# Altium project AL1000.PrjPcb
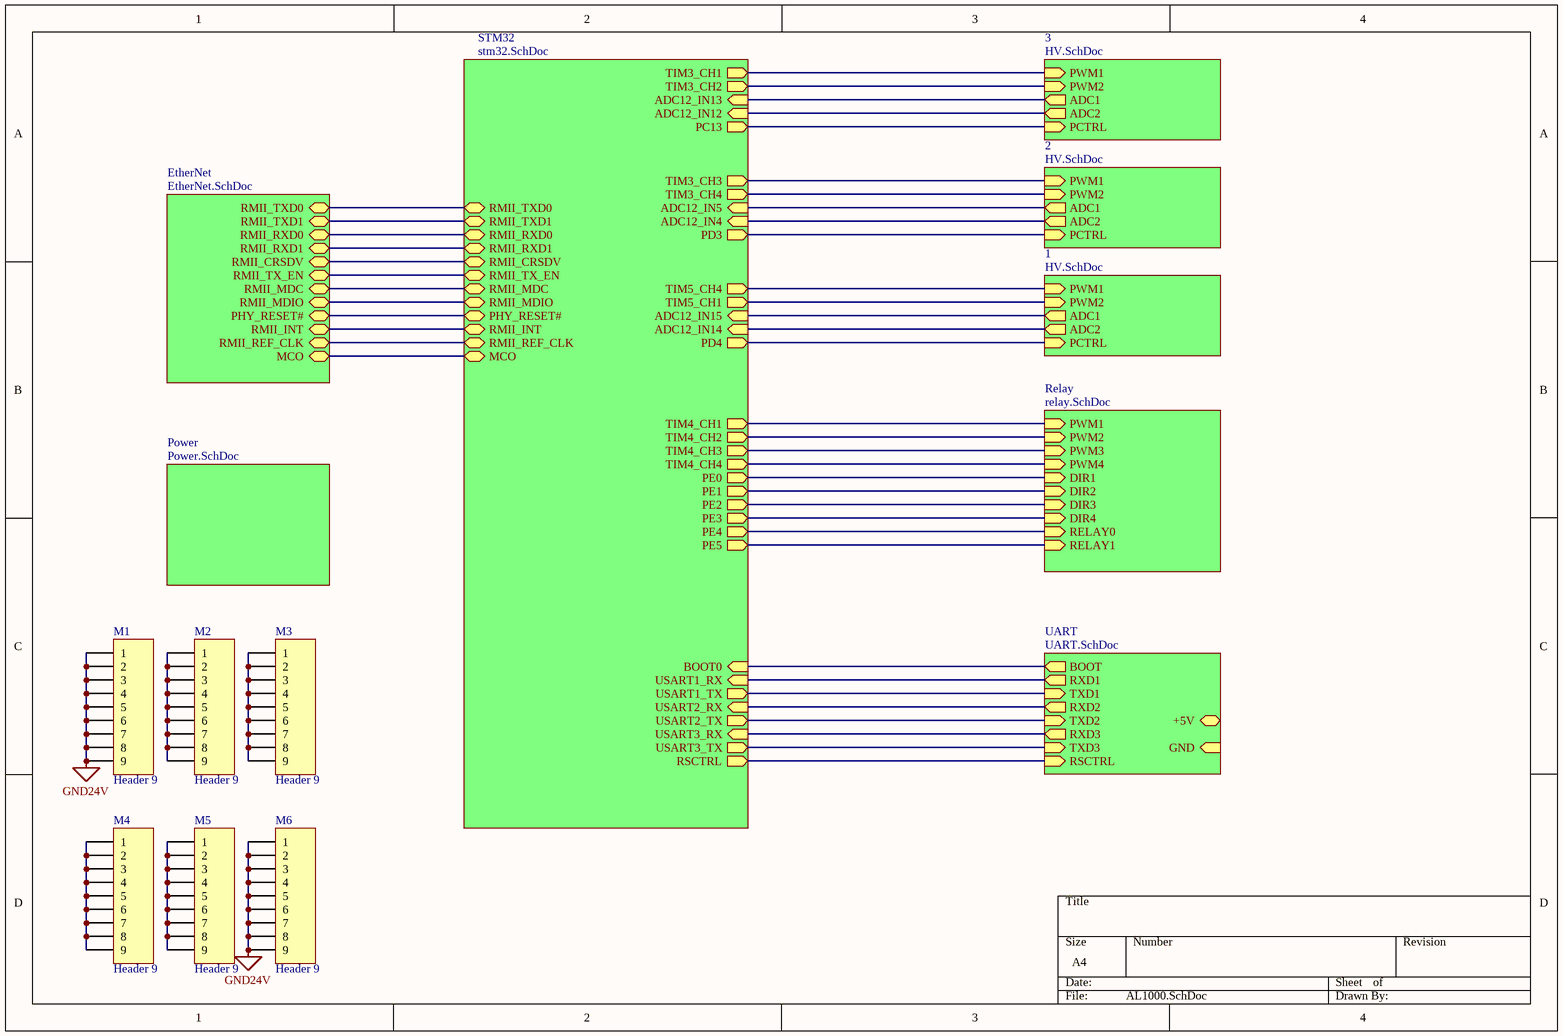
[diagram p0: AL1000.SchDoc]
7 sheets, 486 parts. Net scope: hierarchical (ports join the sheet entries above them; power ports are global).
Board file: AL1000.PcbDoc
Sheets:
  AL1000.SchDoc
    STM32 = stm32.SchDoc
    1 = HV.SchDoc
    Relay = relay.SchDoc
    UART = uart.SchDoc
    EtherNet = EtherNet.SchDoc
    Power = POWER.SchDoc
    3 = HV.SchDoc
    2 = HV.SchDoc

## Sheet AL1000.SchDoc
size A4; PageSetup: Record=PageOptions|CenterHorizontal=True|CenterVertical=True|PrintScale=1.00|XCorrection=1.00|YCorrection=1.00|PrintKind=1|BorderSize=5000000|LeftOffset=0|BottomOffset=0|Orientation=2|PaperLength=1000|PaperWidth=1000|Scale=100|PaperSource=7|PrintQuality=-3|MediaType=1|DitherType=10|PrintScaleMode=1|PaperKind=A1(594x841mm)|PaperIndex=135

### Parts
M1  Header 9  [LK]
M2  Header 9  [LK]
M3  Header 9  [LK]
M4  Header 9  [LK]
M5  Header 9  [LK]
M6  Header 9  [LK]

### Sub-sheets
1 = HV.SchDoc: ADC1 (out), ADC2 (out), PWM1 (in), PWM2 (in), PCTRL (in)
2 = HV.SchDoc: ADC1 (out), ADC2 (out), PWM1 (in), PWM2 (in), PCTRL (in)
3 = HV.SchDoc: ADC1 (out), ADC2 (out), PWM1 (in), PWM2 (in), PCTRL (in)
EtherNet = EtherNet.SchDoc: RMII_TXD0, RMII_TXD1, RMII_RXD0, RMII_RXD1, RMII_CRSDV, RMII_TX_EN, RMII_MDC, RMII_MDIO, PHY_RESET#, RMII_INT, RMII_REF_CLK, MCO
Power = Power.SchDoc: no entries
Relay = relay.SchDoc: DIR2 (in), DIR1 (in), PWM1 (in), PWM2 (in), PWM3 (in), PWM4 (in), DIR3 (in), DIR4 (in), RELAY0 (in), RELAY1 (in)
STM32 = stm32.SchDoc: TIM3_CH1 (out), TIM3_CH2 (out), TIM3_CH3 (out), TIM3_CH4 (out), ADC12_IN12 (in), ADC12_IN13 (in), ADC12_IN14 (in), ADC12_IN15 (in), PD3 (out), PD4 (out), RMII_TXD0, RMII_TXD1, RMII_RXD0, RMII_RXD1, RMII_CRSDV, RMII_TX_EN, RMII_MDC, RMII_MDIO, PHY_RESET#, RMII_INT, RMII_REF_CLK, MCO, USART1_TX (out), USART1_RX (in), USART2_TX (out), USART3_TX (out), USART2_RX (in), USART3_RX (in), RSCTRL (out), BOOT0 (in), TIM4_CH1 (out), TIM4_CH2 (out), TIM4_CH3 (out), TIM4_CH4 (out), PE0 (out), PE1 (out), PE2 (out), PE3 (out), TIM5_CH1 (out), TIM5_CH4 (out), ADC12_IN4 (in), ADC12_IN5 (in), PC13 (out), PE4 (out), PE5 (out)
UART = UART.SchDoc: BOOT (out), RXD1 (out), TXD1 (in), RXD2 (out), TXD2 (in), RXD3 (out), TXD3 (in), GND (in), +5V, RSCTRL (in)

### Nets
GND24V: M1.1 M1.2 M1.3 M1.4 M1.5 M1.6 M1.7 M1.8 M1.9 M6.1 M6.2 M6.3 M6.4 M6.5 M6.6 M6.7 M6.8 M6.9
PC1: sheet STM32/RMII_MDC, sheet EtherNet/RMII_MDC
PC2: sheet STM32/ADC12_IN12, sheet 3/ADC2
PC3: sheet STM32/ADC12_IN13, sheet 3/ADC1
PC4: sheet STM32/ADC12_IN14, sheet 1/ADC2
PC5: sheet STM32/ADC12_IN15, sheet 1/ADC1
PC6: sheet STM32/TIM3_CH1, sheet 3/PWM1
PC7: sheet STM32/TIM3_CH2, sheet 3/PWM2
PC8: sheet STM32/TIM3_CH3, sheet 2/PWM1
PC9: sheet STM32/TIM3_CH4, sheet 2/PWM2
PC10: sheet STM32/USART3_TX, sheet UART/TXD3
PC11: sheet STM32/USART3_RX, sheet UART/RXD3
PC13: sheet STM32/PC13, sheet 3/PCTRL
NetC42_2_2: sheet STM32/ADC12_IN5, sheet 2/ADC1
NetC46_2_2: sheet STM32/ADC12_IN4, sheet 2/ADC2
NetD4_1: sheet STM32/PE2, sheet Relay/DIR3
NetD4_2: sheet STM32/PE3, sheet Relay/DIR4
NetD4_3: sheet STM32/PE4, sheet Relay/RELAY0
NetD4_4: sheet STM32/PE5, sheet Relay/RELAY1
NetD4_23: sheet STM32/TIM5_CH1, sheet 1/PWM2
NetD4_24: sheet STM32/RMII_REF_CLK, sheet EtherNet/RMII_REF_CLK
NetD4_25: sheet STM32/RMII_MDIO, sheet EtherNet/RMII_MDIO
NetD4_26: sheet STM32/TIM5_CH4, sheet 1/PWM1
NetD4_48: sheet STM32/RMII_TX_EN, sheet EtherNet/RMII_TX_EN
NetD4_51: sheet STM32/RMII_TXD0, sheet EtherNet/RMII_TXD0
NetD4_52: sheet STM32/RMII_TXD1, sheet EtherNet/RMII_TXD1
NetD4_53: sheet STM32/RMII_INT, sheet EtherNet/RMII_INT
NetD4_55: sheet STM32/RMII_CRSDV, sheet EtherNet/RMII_CRSDV
NetD4_56: sheet STM32/RMII_RXD0, sheet EtherNet/RMII_RXD0
NetD4_57: sheet STM32/RMII_RXD1, sheet EtherNet/RMII_RXD1
NetD4_58: sheet STM32/PHY_RESET#, sheet EtherNet/PHY_RESET#
NetD4_59: sheet STM32/TIM4_CH1, sheet Relay/PWM1
NetD4_60: sheet STM32/TIM4_CH2, sheet Relay/PWM2
NetD4_61: sheet STM32/TIM4_CH3, sheet Relay/PWM3
NetD4_62: sheet STM32/TIM4_CH4, sheet Relay/PWM4
NetD4_67: sheet STM32/MCO, sheet EtherNet/MCO
NetD4_68: sheet STM32/USART1_TX, sheet UART/TXD1
NetD4_69: sheet STM32/USART1_RX, sheet UART/RXD1
NetD4_84: sheet STM32/PD3, sheet 2/PCTRL
NetD4_85: sheet STM32/PD4, sheet 1/PCTRL
NetD4_86: sheet STM32/USART2_TX, sheet UART/TXD2
NetD4_87: sheet STM32/USART2_RX, sheet UART/RXD2
NetD4_88: sheet STM32/RSCTRL, sheet UART/RSCTRL
NetD4_94: sheet STM32/BOOT0, sheet UART/BOOT
NetD4_97: sheet STM32/PE0, sheet Relay/DIR1
NetD4_98: sheet STM32/PE1, sheet Relay/DIR2
NetM2_1: M2.1 M2.2 M2.3 M2.4 M2.5 M2.6 M2.7 M2.8 M2.9
NetM3_1: M3.1 M3.2 M3.3 M3.4 M3.5 M3.6 M3.7 M3.8 M3.9
NetM4_1: M4.1 M4.2 M4.3 M4.4 M4.5 M4.6 M4.7 M4.8 M4.9
NetM5_1: M5.1 M5.2 M5.3 M5.4 M5.5 M5.6 M5.7 M5.8 M5.9

### Library data of the parts
M1-M6 = Header 9: Header, 9-Pin; LatestRevisionDate: 17-Jul-2002; LatestRevisionNote: Re-released for DXP Platform.; Publisher: Altium Limited

## Sheet stm32.SchDoc
size A3; PageSetup: Record=PageOptions|CenterHorizontal=True|CenterVertical=True|PrintScale=0.73|XCorrection=1.00|YCorrection=1.00|PrintKind=0|BorderSize=5000000|LeftOffset=0|BottomOffset=0|Orientation=2|PaperLength=1000|PaperWidth=1000|Scale=100|PaperSource=7|PrintQuality=600|MediaType=1|DitherType=10|PaperKind=A4|PrintScaleMode=1
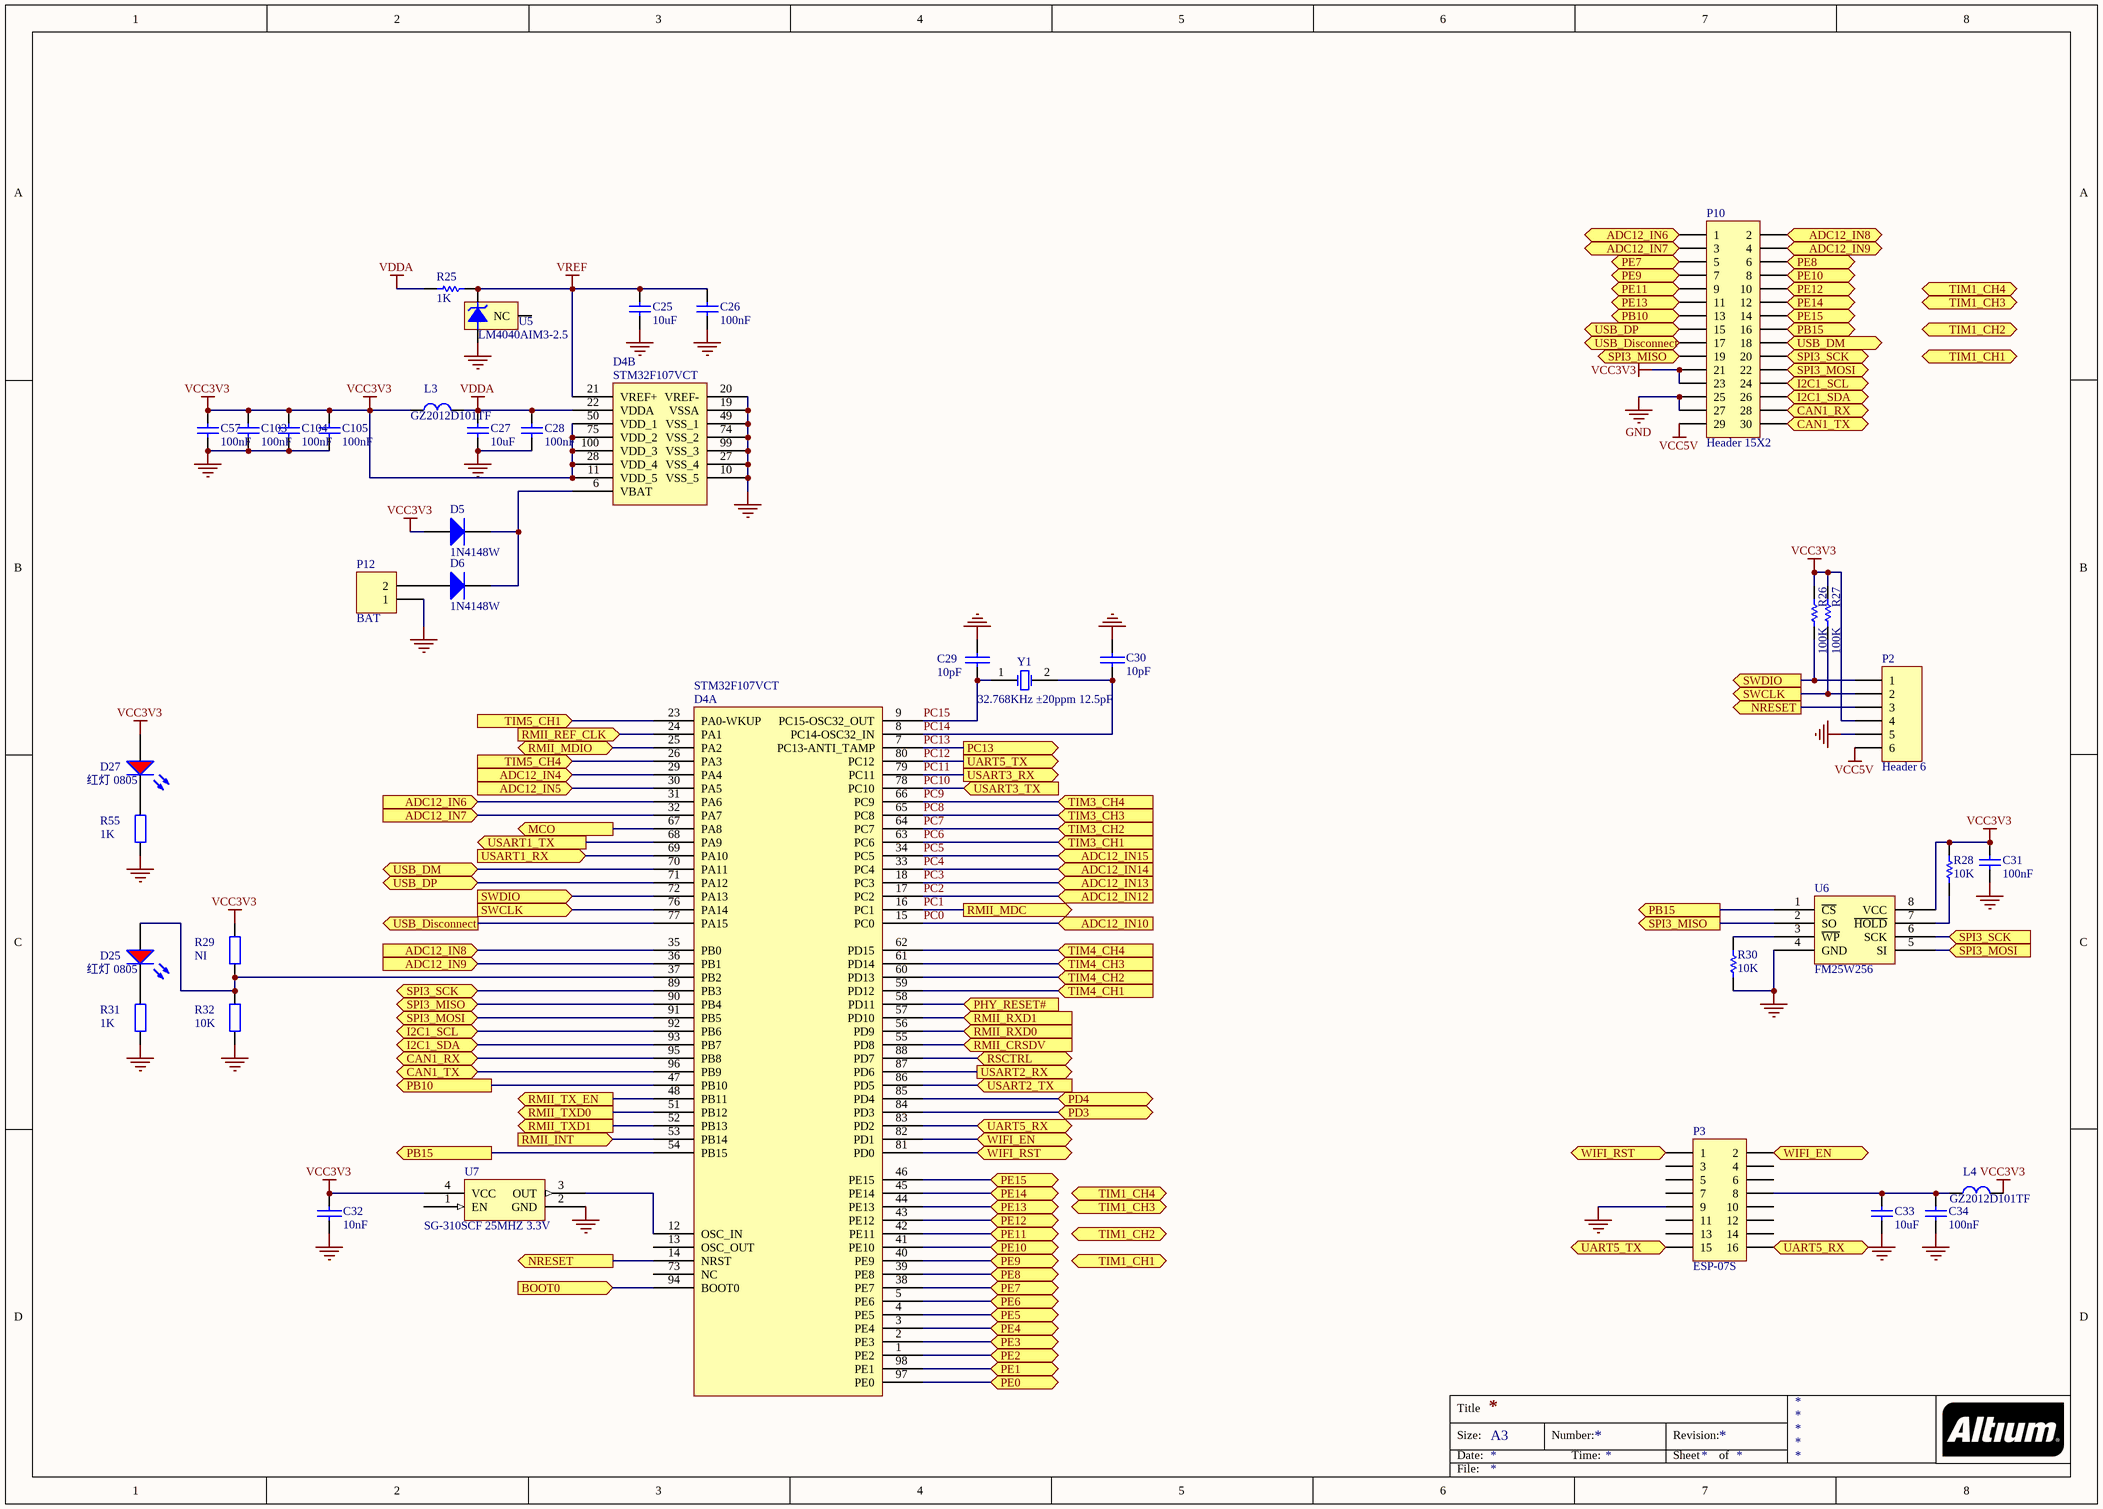
[diagram p1: stm32.SchDoc]

### Parts
C25  10uF  [0805_C]
C26  100nF  [0805_C]
C27  10uF  [0805_C]
C28  100nF  [0805_C]
C29  10pF  [0805_C]
C30  10pF  [0805_C]
C31  100nF  [0805_C]
C32  10nF  [0805_C]
C33  10uF  [0805_C]
C34  100nF  [0805_C]
C57  100nF  [0805_C]
C103  100nF  [0805_C]
C104  100nF  [0805_C]
C105  100nF  [0805_C]
D4  STM32F107VCT  [LQFP-100_14x14x05P]  (parts A,B of 2)
D5  1N4148W  [SOD-123]
D6  1N4148W  [SOD-123]
D25  红灯 0805  [0805_LED_S1]
D27  红灯 0805  [0805_LED_S1]
L3  GZ2012D101TF  [0805_L]
L4  GZ2012D101TF  [0805_L]
P2  Header 6  [TJC3-6A]
P3  ESP-07S  [ESP-07S]
P10  Header 15X2  [HDR2X15]
P12  BAT  [TJC3-2A]
R25  1K  [0805_R]
R26  100K  [0805_R]
R27  100K  [0805_R]
R28  10K  [0805_R]
R29  NI  [0805_R]
R30  10K  [0805_R]
R31  1K  [0805_R]
R32  10K  [0805_R]
R55  1K  [0805_R]
U5  LM4040AIM3-2.5  [MF03A_N]
U6  FM25W256  [SO8]
U7  SG-310SCF 25MHZ 3.3V  [SMD-3225_4P]
Y1  32.768KHz ±20ppm 12.5pF  [SMD-3215_2P FC - 135]

### Ports
ADC12_IN4 (in), ADC12_IN5 (in), ADC12_IN6 (in), ADC12_IN7 (in), ADC12_IN8 (in), ADC12_IN9 (in), ADC12_IN10 (in), ADC12_IN12 (in), ADC12_IN13 (in), ADC12_IN14 (in), ADC12_IN15 (in), BOOT0 (in), CAN1_RX, CAN1_TX, I2C1_SCL, I2C1_SDA, MCO (out), NRESET (out), PB10 (out), PB15 (out), PC13 (out), PD3, PD4, PE0, PE1, PE2, PE3, PE4, PE5, PE6, PE7, PE8, PE9, PE10, PE11, PE12, PE13, PE14, PE15, PHY_RESET# (in), RMII_CRSDV (in), RMII_INT (in), RMII_MDC (out), RMII_MDIO (bidir), RMII_REF_CLK (in), RMII_RXD0 (in), RMII_RXD1 (in), RMII_TX_EN (out), RMII_TXD0 (out), RMII_TXD1 (out), RSCTRL, SPI3_MISO, SPI3_MISO (out), SPI3_MOSI, SPI3_MOSI (in), SPI3_SCK, SPI3_SCK (in), SWCLK (in), SWCLK (out), SWDIO (in), SWDIO (out), TIM1_CH1 (in), TIM1_CH2 (in), TIM1_CH3 (in), TIM1_CH4 (in), TIM3_CH1 (in), TIM3_CH2 (in), TIM3_CH3 (in), TIM3_CH4 (in), TIM4_CH1 (in), TIM4_CH2 (in), TIM4_CH3 (in), TIM4_CH4 (in), TIM5_CH1 (in), TIM5_CH4 (in), UART5_RX, UART5_TX (out), USART1_RX (in), USART1_TX (out), USART2_RX (out), USART2_TX (in), USART3_RX (out), USART3_TX (in), USB_Disconnect (out), USB_DM (bidir), USB_DP (bidir), WIFI_EN, WIFI_RST

### Nets
GND: C25.1 C26.2 C27.1 C28.2 C29.1 C30.2 C31.1 C32.1 C33.1 C34.2 C57.2 C103.1 C104.1 C105.1 D4.10(VSS_5) D4.19(VSSA) D4.20(VREF-) D4.27(VSS_4) D4.49(VSS_1) D4.74(VSS_2) D4.99(VSS_3) P2.5 P3.9 P10.25 P10.27 P12.1 R30.2 R31.2 R32.2 R55.2 U5.2(-V) U6.4(GND) U7.2(GND)
VCC3V3: C31.2 C32.2 C57.1 C103.2 C104.2 C105.2 D4.11(VDD_5) D4.28(VDD_4) D4.50(VDD_1) D4.75(VDD_2) D4.100(VDD_3) D5.1(A) D27.A L3.1 L4.2 P2.4 P10.21 P10.23 R26.2 R27.2 R28.2 R29.1 U6.8(VCC) U7.4(VCC)
VCC5V: P2.6 P10.29
VDDA: C27.2 C28.1 D4.22(VDDA) L3.2 R25.1
VREF: C25.2 C26.1 D4.21(VREF+) R25.2 U5.1(+V)
PC0: D4.15(PC0) ; port ADC12_IN10
PC1: D4.16(PC1) ; port RMII_MDC
PC2: D4.17(PC2) ; port ADC12_IN12
PC3: D4.18(PC3) ; port ADC12_IN13
PC4: D4.33(PC4) ; port ADC12_IN14
PC5: D4.34(PC5) ; port ADC12_IN15
PC6: D4.63(PC6) ; port TIM3_CH1
PC7: D4.64(PC7) ; port TIM3_CH2
PC8: D4.65(PC8) ; port TIM3_CH3
PC9: D4.66(PC9) ; port TIM3_CH4
PC10: D4.78(PC10) ; port USART3_TX
PC11: D4.79(PC11) ; port USART3_RX
PC12: D4.80(PC12) P3.15 ; port UART5_TX
PC13: D4.7(PC13-ANTI_TAMP) ; port PC13
PC14: C30.1 D4.8(PC14-OSC32_IN) Y1.2(OSC2)
PC15: C29.2 D4.9(PC15-OSC32_OUT) Y1.1(OSC1)
NetC33_2: C33.2 C34.1 L4.1 P3.8
NetC42_2_2: D4.30(PA5) ; port ADC12_IN5
NetC46_2_2: D4.29(PA4) ; port ADC12_IN4
NetD4_1: D4.1(PE2) ; port PE2
NetD4_2: D4.2(PE3) ; port PE3
NetD4_3: D4.3(PE4) ; port PE4
NetD4_4: D4.4(PE5) ; port PE5
NetD4_5: D4.5(PE6) ; port PE6
NetD4_6: D4.6(VBAT) D5.2(K) D6.2(K)
NetD4_12: D4.12(OSC_IN) U7.3(OUT)
NetD4_14: D4.14(NRST) P2.3 ; port NRESET
NetD4_23: D4.23(PA0-WKUP) ; port TIM5_CH1
NetD4_24: D4.24(PA1) ; port RMII_REF_CLK
NetD4_25: D4.25(PA2) ; port RMII_MDIO
NetD4_26: D4.26(PA3) ; port TIM5_CH4
NetD4_31: D4.31(PA6) P10.1 ; port ADC12_IN6
NetD4_32: D4.32(PA7) P10.3 ; port ADC12_IN7
NetD4_35: D4.35(PB0) P10.2 ; port ADC12_IN8
NetD4_36: D4.36(PB1) P10.4 ; port ADC12_IN9
NetD4_37: D4.37(PB2) D25.A R29.2 R32.1
NetD4_38: D4.38(PE7) P10.5 ; port PE7
NetD4_39: D4.39(PE8) P10.6 ; port PE8
NetD4_40: D4.40(PE9) P10.7 ; port PE9
NetD4_41: D4.41(PE10) P10.8 ; port PE10
NetD4_42: D4.42(PE11) P10.9 ; port PE11
NetD4_43: D4.43(PE12) P10.10 ; port PE12
NetD4_44: D4.44(PE13) P10.11 ; port PE13
NetD4_45: D4.45(PE14) P10.12 ; port PE14
NetD4_46: D4.46(PE15) P10.14 ; port PE15
NetD4_47: D4.47(PB10) P10.13 ; port PB10
NetD4_48: D4.48(PB11) ; port RMII_TX_EN
NetD4_51: D4.51(PB12) ; port RMII_TXD0
NetD4_52: D4.52(PB13) ; port RMII_TXD1
NetD4_53: D4.53(PB14) ; port RMII_INT
NetD4_54: D4.54(PB15) P10.16 U6.1(~{CS}) ; port PB15
NetD4_55: D4.55(PD8) ; port RMII_CRSDV
NetD4_56: D4.56(PD9) ; port RMII_RXD0
NetD4_57: D4.57(PD10) ; port RMII_RXD1
NetD4_58: D4.58(PD11) ; port PHY_RESET#
NetD4_59: D4.59(PD12) ; port TIM4_CH1
NetD4_60: D4.60(PD13) ; port TIM4_CH2
NetD4_61: D4.61(PD14) ; port TIM4_CH3
NetD4_62: D4.62(PD15) ; port TIM4_CH4
NetD4_67: D4.67(PA8) ; port MCO
NetD4_68: D4.68(PA9) ; port USART1_TX
NetD4_69: D4.69(PA10) ; port USART1_RX
NetD4_70: D4.70(PA11) P10.18 ; port USB_DM
NetD4_71: D4.71(PA12) P10.15 ; port USB_DP
NetD4_72: D4.72(PA13) P2.1 R26.1 ; port SWDIO
NetD4_76: D4.76(PA14) P2.2 R27.1 ; port SWCLK
NetD4_77: D4.77(PA15) P10.17 ; port USB_Disconnect
NetD4_81: D4.81(PD0) P3.1 ; port WIFI_RST
NetD4_82: D4.82(PD1) P3.2 ; port WIFI_EN
NetD4_83: D4.83(PD2) P3.16 ; port UART5_RX
NetD4_84: D4.84(PD3) ; port PD3
NetD4_85: D4.85(PD4) ; port PD4
NetD4_86: D4.86(PD5) ; port USART2_TX
NetD4_87: D4.87(PD6) ; port USART2_RX
NetD4_88: D4.88(PD7) ; port RSCTRL
NetD4_89: D4.89(PB3) P10.20 U6.6(SCK) ; port SPI3_SCK
NetD4_90: D4.90(PB4) P10.19 U6.2(SO) ; port SPI3_MISO
NetD4_91: D4.91(PB5) P10.22 U6.5(SI) ; port SPI3_MOSI
NetD4_92: D4.92(PB6) P10.24 ; port I2C1_SCL
NetD4_93: D4.93(PB7) P10.26 ; port I2C1_SDA
NetD4_94: D4.94(BOOT0) ; port BOOT0
NetD4_95: D4.95(PB8) P10.28 ; port CAN1_RX
NetD4_96: D4.96(PB9) P10.30 ; port CAN1_TX
NetD4_97: D4.97(PE0) ; port PE0
NetD4_98: D4.98(PE1) ; port PE1
NetD6_1: D6.1(A) P12.2
NetD25_K: D25.K R31.1
NetD27_K: D27.K R55.1
NetR28_1: R28.1 U6.7(~{HOLD})
NetR30_1: R30.1 U6.3(~{WP})

Not connected (* = marked no-connect by the designer): D4 13(OSC_OUT) 73(NC); P3 3 4 5 6 7 10 11 12 13 14; U5 3(NC); U7 1(EN)

### Notes on the sheet
- Title
- Size:
- Date:
- A3
- Number:
- Time:
- Revision:
- Sheet
- of
- File:

### Library data of the parts
C25 C27 C33 = 0805 10uF (106) 10% 25V: 贴片电容; ComponentLink1Description: 供应商链接; ComponentLink1URL: http://www.szlcsc.com/product/details_16532.html; Package: 0805; Supplier: LC; SuppliersPartNumber: C15850
C26 C28 C31 C34 C57 C103-C105 = 0805 100nF(104) 10% 50V: 贴片电容; ComponentLink1Description: 供应商链接; ComponentLink1URL: http://www.szlcsc.com/product/details_50686.html; Package: 0805; Supplier: LC; SuppliersPartNumber: C49678
C29 C30 = CAP: Capacitor
C32 = G-CC41-0805-CG-50V-300J: 多层瓷介电容; 厂家: 元六; 质量保证等级: G; 质量等级: A2; 技术规范: Q/QYL20024-; 是否在目录内: 1N 2Y; 供货周期: 28; VALUE: G-CC41-0805-CG-50V-300J
D4 = BARRACUDA_256K: VALUE: MCU电路STM32F107VCT6; 厂家: ST
D5 D6 = Diode: Default Diode; Published: 8-Jun-2000; LatestRevisionDate: 17-Jul-2002; LatestRevisionNote: Re-released for DXP Platform.; PackageVersion: Sep-1996; PackageReference: SMC; Publisher: Altium Limited; Code_JEDEC: DO-214-AB
D25 D27 = 0805 红灯: 发光二极管; ComponentLink1Description: 供应商链接; ComponentLink1URL: http://www.szlcsc.com/product/details_2668.html; Package: 0805; Supplier: LC; SuppliersPartNumber: C2295
L3 L4 = L1: VALUE: 磁珠742792031; 厂家: 伍尔特
P2 = Header 6: Header, 6-Pin; LatestRevisionDate: 17-Jul-2002; LatestRevisionNote: Re-released for DXP Platform.; Publisher: Altium Limited
P3 = Header 8X2: Header, 8-Pin, Dual row; LatestRevisionDate: 17-Jul-2002; LatestRevisionNote: Re-released for DXP Platform.; Publisher: Altium Limited
P10 = Header 15X2: Header, 15-Pin, Dual row; LatestRevisionDate: 17-Jul-2002; LatestRevisionNote: Re-released for DXP Platform.; Publisher: Altium Limited
P12 = Header 2: Header, 2-Pin; LatestRevisionDate: 17-Jul-2002; LatestRevisionNote: Re-released for DXP Platform.; Publisher: Altium Limited
R25 = res1: Resistor; Published: 8-Jun-2000; Revision: July-2002: Re-released for DXP Platform.; Publisher: Altium Limited; Value: 1K
R26-R28 = Res1: Resistor; Value: 1K; Published: 8-Jun-2000; LatestRevisionDate: 17-Jul-2002; LatestRevisionNote: Re-released for DXP Platform.; PackageReference: AXIAL-0.3; Publisher: Altium Limited
R29 = RMK2012KBxxx（10～1M）F: 贴片电阻; 质量保证等级: GJB; 技术规范: GJB1432A-99; 厂家: 718厂; VALUE: RMK2012KBxxxF
R30 = res1: Resistor; Value: 1K; Published: 8-Jun-2000; Revision: July-2002: Re-released for DXP Platform.; Publisher: Altium Limited
R31 R55 = RMK2012KBxxx（10～1M）F: 贴片电阻; 质量保证等级: GJB; 技术规范: GJB1432A-99; 厂家: 718厂; VALUE: RMK2012KB102F
R32 = RMK2012KBxxx（10～1M）F: 贴片电阻; 质量保证等级: GJB; 技术规范: GJB1432A-99; 厂家: 718厂; VALUE: RMK2012KB103F
U5 = LM4040AIM3-2.5: Precision Micropower Shunt Voltage Reference, 3-pin SOT-23; Manufacturer: National Semiconductor; PackageTopMarking: R2A*XTT; PowerWise: N; CompType: Voltage Reference IC; High-Reliability: Y; DatasheetVersion: Apr-2005; PackageVersion: revB, Mar-2003; PackageReference: MF03A; PackageDescription: Molded SOT-23, .115 x .051 x .037in Body, 3 Lead, .075 in Pitch; PartNumber: LM4040AIM3-2.5; RoHS: N; PinCount: 3; ComponentLink1Description: Manufacturer URL; ComponentLink1URL: http://www.national.com/; ComponentLink2Description: LM4040 Datasheet; ComponentLink2URL: http://www.national.com/ds/LM/LM4040.pdf; ComponentLink3Description: LM4040 Web Page; ComponentLink3URL: http://www.national.com/pf/LM/LM4040.html; ComponentLink4Description: MF03A Package Page; ComponentLink4URL: http://www.national.com/packaging/folders/mf03a.html
U6 = SPI_FLASH
U7 = SM7745HEV-50.0M
Y1 = SMD-3215_2P 32.768KHz 20ppm 12.5pF: 贴片晶振; ComponentLink1Description: 供应商链接; ComponentLink1URL: http://www.szlcsc.com/product/details_33310.html; Package: SMD-3215_2P; Supplier: LC; SuppliersPartNumber: C32346

## Sheet HV.SchDoc
size A3
Used 3 times, as channels 1, 3, 2. Parts and nets are listed once, with the designators drawn on the sheet.
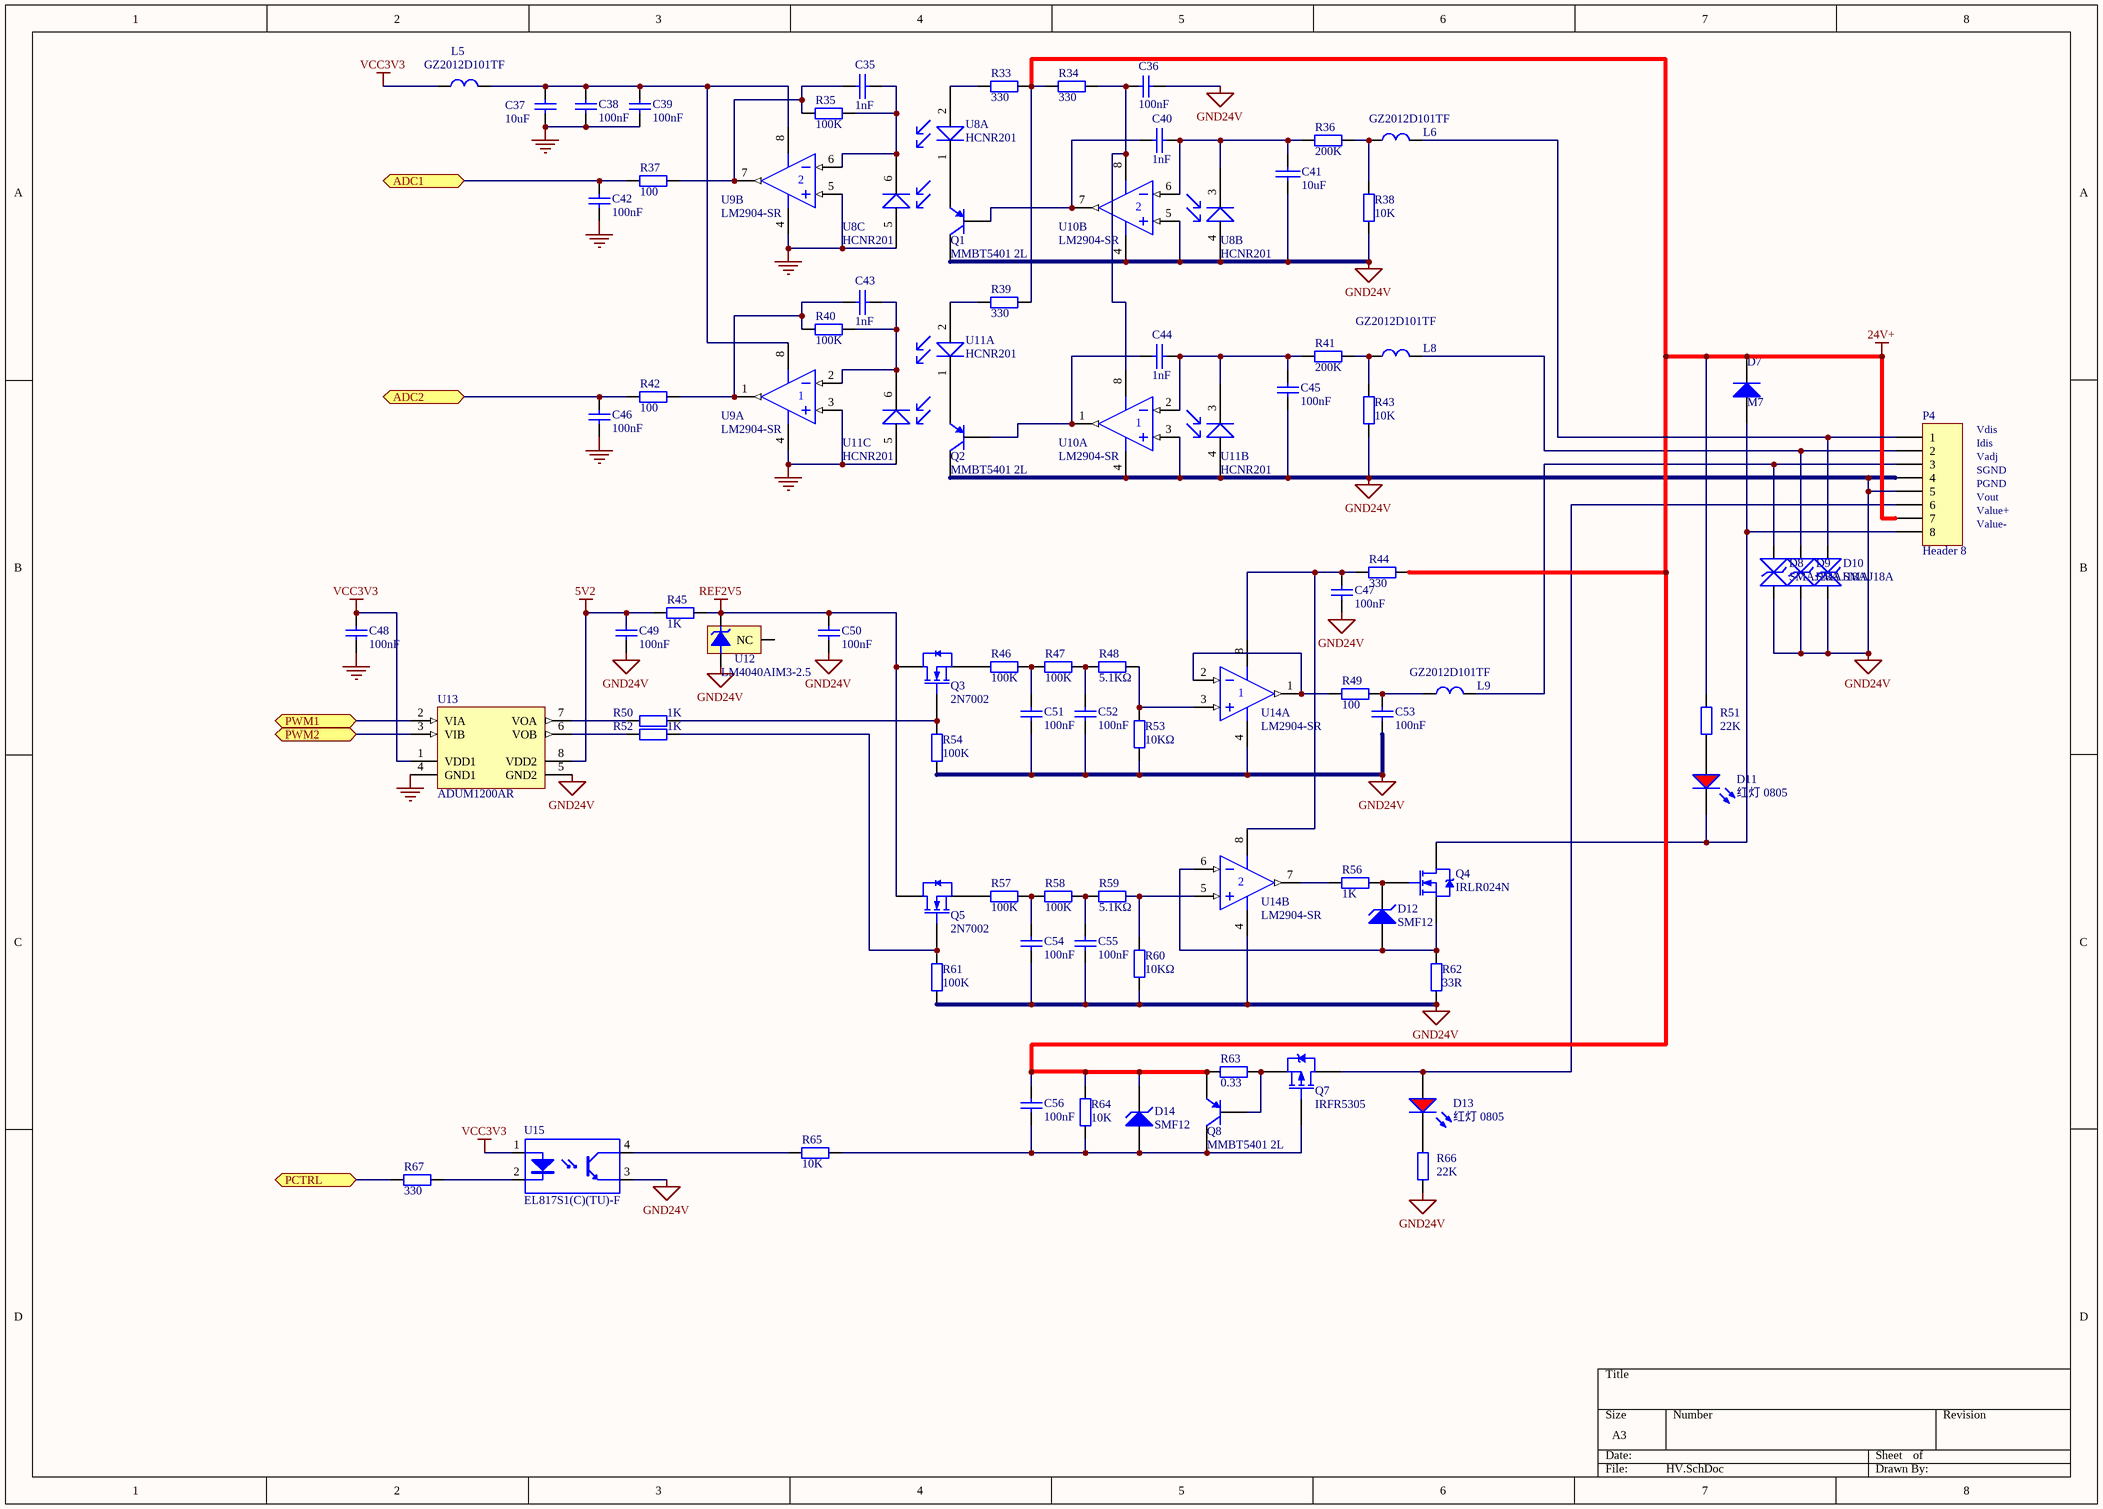
[diagram p2: HV.SchDoc]

### Parts
C35  1nF  [0805_C]
C36  100nF  [0805_C]
C37  10uF  [0805_C]
C38  100nF  [0805_C]
C39  100nF  [0805_C]
C40  1nF  [0805_C]
C41  10uF  [0805_C]
C42  100nF  [0805_C]
C43  1nF  [0805_C]
C44  1nF  [0805_C]
C45  100nF  [0805_C]
C46  100nF  [0805_C]
C47  100nF  [0805_C]
C48  100nF  [0805_C]
C49  100nF  [0805_C]
C50  100nF  [0805_C]
C51  100nF  [0805_C]
C52  100nF  [0805_C]
C53  100nF  [0805_C]
C54  100nF  [0805_C]
C55  100nF  [0805_C]
C56  100nF  [0805_C]
D7  M7  [SMA(DO-214AC)_S1]
D8  SMAJ18A  [SMA]
D9  SMAJ18A  [SMA]
D10  SMAJ18A  [SMA]
D11  红灯 0805  [0805_LED_S1]
D12  SMF12  [SOD-123]
D13  红灯 0805  [0805_LED_S1]
D14  SMF12  [SOD-123]
L5  GZ2012D101TF  [0805_L]
L6  GZ2012D101TF  [0805_L]
L8  GZ2012D101TF  [0805_L]
L9  GZ2012D101TF  [0805_L]
P4  Header 8  [MC1.5/8-ST-3.81]
Q1  MMBT5401 2L  [SOT-23(SOT-23-3)]
Q2  MMBT5401 2L  [SOT-23(SOT-23-3)]
Q3  2N7002  [SOT-23(SOT-23-3)]
Q4  IRLR024N  [TO-252AA_N]
Q5  2N7002  [SOT-23(SOT-23-3)]
Q7  IRFR5305  [TO-252AA_N]
Q8  MMBT5401 2L  [SOT-23(SOT-23-3)]
R33  330  [0805_R]
R34  330  [0805_R]
R35  100K  [0805_R]
R36  200K  [0805_R]
R37  100  [0805_R]
R38  10K  [0805_R]
R39  330  [0805_R]
R40  100K  [0805_R]
R41  200K  [0805_R]
R42  100  [0805_R]
R43  10K  [0805_R]
R44  330  [0805_R]
R45  1K  [0805_R]
R46  100K  [0805_R]
R47  100K  [0805_R]
R48  5.1KΩ  [0805_R]
R49  100  [0805_R]
R50  1K  [0805_R]
R51  22K  [R0805]
R52  1K  [0805_R]
R53  10KΩ  [0805_R]
R54  100K  [0805_R]
R56  1K  [0805_R]
R57  100K  [0805_R]
R58  100K  [0805_R]
R59  5.1KΩ  [0805_R]
R60  10KΩ  [0805_R]
R61  100K  [0805_R]
R62  33R  [R2512]
R63  0.33  [R2512]
R64  10K  [0805_R]
R65  10K  [0805_R]
R66  22K  [0805_R]
R67  330  [0805_R]
U8  HCNR201  [SMD-8_9.0mm]  (parts A,B,C of 3)
U9  LM2904-SR  [SOIC-8_150mil]  (parts A,B of 2)
U10  LM2904-SR  [SOIC-8_150mil]  (parts A,B of 2)
U11  HCNR201  [SMD-8_9.0mm]  (parts A,B,C of 3)
U12  LM4040AIM3-2.5  [MF03A_N]
U13  ADUM1200AR  [ADI-R-8_N]
U14  LM2904-SR  [SOIC-8_150mil]  (parts A,B of 2)
U15  EL817S1(C)(TU)-F  [LC-SMD-4]

### Ports
ADC1, ADC2, PCTRL, PWM1, PWM2

### Nets
5V2: C49.2 R45.2 U13.8(VDD2)
24V+: C56.2 D7.2(K) D14.2(K) P4.7 Q8.2(E) R33.1 R34.2 R39.1 R44.1 R51.1 R63.2 R64.2
GND: C37.1 C38.1 C39.1 C42.1 C46.1 C48.1 U8.5(+) U9.3(IN+) U9.4(V-) U9.5(IN+) U11.5(+) U13.4(GND1)
GND24V: C36.1 C41.1 C45.1 C47.1 C49.1 C50.1 C51.1 C52.1 C53.1 C54.1 C55.1 D8.1 D9.1 D10.1 P4.4 P4.5 Q1.3(C) Q2.3(C) R38.1 R43.1 R53.2 R54.2 R60.2 R61.2 R62.1 R66.2 U8.4(+) U10.3(IN+) U10.4(V-) U10.5(IN+) U11.4(+) U12.2(-V) U13.5(GND2) U14.4(V-) U15.3(E)
REF2V5: C50.2 Q3.3(D) Q5.3(D) R45.1 U12.1(+V)
VCC3V3: C48.2 L5.1 U13.1(VDD1) U15.1(A)
ADC1: C42.2 R37.2 ; port ADC1
ADC2: C46.2 R42.2 ; port ADC2
PCTRL: R67.1 ; port PCTRL
PWM1: U13.2(VIA) ; port PWM1
PWM2: U13.3(VIB) ; port PWM2
NetC35_1: C35.1 R35.2 U8.6(-) U9.6(IN-)
NetC35_2: C35.2 R35.1 R37.1 U9.7(OUT)
NetC36_2: C36.2 R34.1 U10.8(V+)
NetC37_2: C37.2 C38.2 C39.2 L5.2 U9.8(V+)
NetC40_1: C40.1 C41.2 R36.1 U8.3(-) U10.6(IN-)
NetC40_2: C40.2 Q1.1(B) U10.7(OUT)
NetC43_1: C43.1 R40.2 U9.2(IN-) U11.6(-)
NetC43_2: C43.2 R40.1 R42.1 U9.1(OUT)
NetC44_1: C44.1 C45.2 R41.1 U10.2(IN-) U11.3(-)
NetC44_2: C44.2 Q2.1(B) U10.1(OUT)
NetC47_2: C47.2 R44.2 U14.8(V+)
NetC51_2: C51.2 R46.1 R47.2
NetC52_2: C52.2 R47.1 R48.2
NetC53_2: C53.2 L9.2 R49.1
NetC54_2: C54.2 R57.1 R58.2
NetC55_2: C55.2 R58.1 R59.2
NetC56_1: C56.1 D14.1(A) Q7.1(G) Q8.3(C) R64.1 R65.1
NetD7_1: D7.1(A) D11.K P4.8 Q4.4(D)
NetD8_2: D8.2 L9.1 P4.3
NetD9_2: D9.2 L8.2 P4.2
NetD10_2: D10.2 L6.2 P4.1
NetD11_A: D11.A R51.2
NetD12_1: D12.1(A) Q4.3(S) R62.2 U14.6(IN-)
NetD12_2: D12.2(K) Q4.1(G) R56.1
NetD13_A: D13.A P4.6 Q7.4(D)
NetD13_K: D13.K R66.1
NetL6_1: L6.1 R36.2 R38.2
NetL8_1: L8.1 R41.2 R43.2
NetQ1_2: Q1.2(E) U8.1(-)
NetQ2_2: Q2.2(E) U11.1(-)
NetQ3_1: Q3.1(G) R50.2 R54.1
NetQ3_2: Q3.2(S) R46.2
NetQ5_1: Q5.1(G) R52.2 R61.1
NetQ5_2: Q5.2(S) R57.2
NetQ7_3: Q7.3(S) Q8.1(B) R63.1
NetR33_2: R33.2 U8.2(+)
NetR39_2: R39.2 U11.2(+)
NetR48_1: R48.1 R53.1 U14.3(IN+)
NetR49_2: R49.2 U14.1(OUT) U14.2(IN-)
NetR50_1: R50.1 U13.7(VOA)
NetR52_1: R52.1 U13.6(VOB)
NetR56_2: R56.2 U14.7(OUT)
NetR59_1: R59.1 R60.1 U14.5(IN+)
NetR65_2: R65.2 U15.4(C)
NetR67_2: R67.2 U15.2(K)

Not connected (* = marked no-connect by the designer): U12 3(NC)

### Channels
1: designators end in _1; ports ADC1=PC5 ADC2=PC4 PCTRL=NetD4_85 PWM1=NetD4_26 PWM2=NetD4_23
3: designators end in _3; ports ADC1=PC3 ADC2=PC2 PCTRL=PC13 PWM1=PC6 PWM2=PC7
2: designators end in _2; ports ADC1=NetC42_2_2 ADC2=NetC46_2_2 PCTRL=NetD4_84 PWM1=PC8 PWM2=PC9

### Notes on the sheet
- Vdis
- Idis
- Vadj
- SGND
- PGND
- Vout
- Value+
- Value-

### Library data of the parts
C35 C40 C43 C44 = CAP: Capacitor
C36 C38 C39 C42 C45-C56 = 0805 100nF(104) 10% 50V: 贴片电容; ComponentLink1Description: 供应商链接; ComponentLink1URL: http://www.szlcsc.com/product/details_50686.html; Package: 0805; Supplier: LC; SuppliersPartNumber: C49678
C37 = 1206 10uF (106) 10% 50V: 贴片电容; ComponentLink1Description: 供应商链接; ComponentLink1URL: http://www.szlcsc.com/product/details_14236.html; Package: 1206; Supplier: LC; SuppliersPartNumber: C13585
C41 = CC: Capacitor
D7 = SMA(DO-214AC) M7: 二极管; 备注: 1N4007 4007 编号C2464 已经停售, 使用新物料编号C95872; ComponentLink1Description: 供应商链接; ComponentLink1URL: http://www.szlcsc.com/product/details_2841.html; Package: SMA(DO-214AC); Supplier: LC; SuppliersPartNumber: C95872
D8-D10 = TVS
D11 D13 = 0805 红灯: 发光二极管; ComponentLink1Description: 供应商链接; ComponentLink1URL: http://www.szlcsc.com/product/details_2668.html; Package: 0805; Supplier: LC; SuppliersPartNumber: C2295
D12 D14 = D Zener: Zener Diode; Published: 8-Jun-2000; LatestRevisionDate: 17-Jul-2002; LatestRevisionNote: Re-released for DXP Platform.; PackageReference: DIODE-0.7; Publisher: Altium Limited; PackageDescription: Diode, Thru-Hole; 2 Leads; 0.7 in Pin Spacing
L5 L6 L8 L9 = L1
P4 = Header 8: Header, 8-Pin; LatestRevisionDate: 17-Jul-2002; LatestRevisionNote: Re-released for DXP Platform.; Publisher: Altium Limited
Q1 Q2 Q8 = SOT-23 MMBT5401 2L: 三极管; ComponentLink1Description: 供应商链接; ComponentLink1URL: http://www.szlcsc.com/product/details_8818.html; Package: SOT-23; Supplier: LC; SuppliersPartNumber: C8326
Q3 Q5 = 2N7002 7002: MOS(场效应管); ComponentLink1Description: 供应商链接; ComponentLink1URL: http://www.szlcsc.com/product/details_9040.html; Package: SOT-23(SOT-23-3); Supplier: LC; SuppliersPartNumber: C8545
Q4 = IRLR024N: HEXFET Power MOSFET; Note: Pin 2 is trimmed and is electrically connected to Drain.; Published: 8-Jun-2000; LatestRevisionDate: 20-Nov-2009; LatestRevisionNote: IPC-7351 Footprint Added.; PackageVersion: Feb-2003; PackageReference: TO-252AA; Publisher: Altium Limited; PackageDescription: 3-Pin HEXFET Package 2.28 mm Pitch, 9.9 mm Lead Span; Code_JEDEC: TO-252-AA; ComponentLink1Description: Manufacturer Link; ComponentLink1URL: http://www.irf.com/; ComponentLink2Description: Datasheet; ComponentLink2URL: http://www.irf.com/product-info/datasheets/data/irlr024n.pdf
Q7 = IRFR5305: HEXFET Power MOSFET; Note: Pin 2 is trimmed and is electrically connected to Drain.; Published: 8-Jun-2000; LatestRevisionDate: 20-Nov-2009; LatestRevisionNote: IPC-7351 Footprint Added.; DatasheetVersion: PD-9.1402; PackageReference: TO-252AA; Publisher: Altium Limited; PackageDescription: 3-Pin HEXFET Package 2.28 mm Pitch, 9.9 mm Lead Span; ComponentLink1Description: Manufacturer Link; ComponentLink1URL: http://www.irf.com/; ComponentLink2Description: Datasheet; ComponentLink2URL: http://www.irf.com/product-info/datasheets/data/irfr5305.pdf; PackageVersion: Feb-2003; Code_JEDEC: TO-252-AA
R33-R43 R62-R65 R67 = Res2: Resistor; Value: 1K; Published: 8-Jun-2000; LatestRevisionDate: 17-Jul-2002; LatestRevisionNote: Re-released for DXP Platform.; PackageReference: AXIAL-0.4; Publisher: Altium Limited
R44 = 0805 100Ω (1000) 1%: 贴片电阻; ComponentLink1Description: 供应商链接; ComponentLink1URL: http://www.szlcsc.com/product/details_18096.html; Package: 0805; Supplier: LC; SuppliersPartNumber: C17408
R45-R47 R49 R50 R52 R54 R56-R58 R61 = 0805 100KΩ (1003) 1%: 贴片电阻; ComponentLink1Description: 供应商链接; ComponentLink1URL: http://www.szlcsc.com/product/details_18095.html; Package: 0805; Supplier: LC; SuppliersPartNumber: C17407
R48 R59 = 0805 5.1KΩ (5101) 1%: 贴片电阻; ComponentLink1Description: 供应商链接; ComponentLink1URL: http://www.szlcsc.com/product/details_28584.html; Package: 0805; Supplier: LC; SuppliersPartNumber: C27834
R51 R66 = RMK2012KBxxx（10～1M）F: as R31 on sheet stm32
R53 R60 = 0805 10KΩ (1002) 1%: 贴片电阻; ComponentLink1Description: 供应商链接; ComponentLink1URL: http://www.szlcsc.com/product/details_18102.html; Package: 0805; Supplier: LC; SuppliersPartNumber: C17414
U9 U10 U14 = LM2904D: Dual Low-Power Operational Amplifier; Published: 17-Jul-2002; LatestRevisionDate: 13-Apr-2006; LatestRevisionNote: IPC-7351 Footprint Added.; DatasheetVersion: 1988; PackageReference: 751-02; Publisher: Altium Limited; PackageDescription: 8-Pin Small Outline Integrated Circuit 1.27 mm Pitch; Code_JEDEC: MS-012-AA; Code_IPC: SOIC127P600-8; ComponentLink1Description: Manufacturer Link; ComponentLink1URL: http://www.onsemi.com/site/products/parametrics/0,4446,251,00.html; ComponentLink2Description: Datasheet; ComponentLink2URL: http://www.onsemi.com/pub/Collateral/LM358-D.PDF
U12 = LM4040AIM3-2.5: as U5 on sheet stm32; DatasheetVersion: Apr-2005; PackageVersion: revB, Mar-2003; PackageReference: MF03A; PackageDescription: Molded SOT-23, .115 x .051 x .037in Body, 3 Lead, .075 in Pitch; PartNumber: LM4040AIM3-2.5; RoHS: N; PinCount: 3; ComponentLink1Description: Manufacturer URL; ComponentLink1URL: http://www.national.com/; ComponentLink2Description: LM4040 Datasheet; ComponentLink2URL: http://www.national.com/ds/LM/LM4040.pdf; ComponentLink3Description: LM4040 Web Page; ComponentLink3URL: http://www.national.com/pf/LM/LM4040.html; ComponentLink4Description: MF03A Package Page; ComponentLink4URL: http://www.national.com/packaging/folders/mf03a.html
U13 = ADUM1200AR: Dual Channel Digital Isolator, 2.5 KV rms Insulation Rating, 1 Mbps Data Rate, 150 ns Delay, Industrial, 8-pin SOIC (R-8), Tube; Manufacturer: Analog Devices; Insulation Rating (kVrms): 2.5; Max Data Rate: 1Mbps; DatasheetVersion: Rev. I; PackageVersion: 060506-A, 06/2006; PackageReference: R-8; PackageDescription: 8-Pin Standard Small Outline Package, Body 4.9 x 3.9 mm, Pitch 1.27 mm; Supplier 1: Digi-Key; Supplier Part Number 1: ADUM1200AR-ND; Supplier 2: Mouser; Supplier Part Number 2: 584-ADUM1200AR; Max Operating Temp (degreesC): 125; Mounting Technology: Surface Mount; Code_JEDEC: MS-012-AA; PartNumber: ADUM1200AR; ComponentLink1Description: Manufacturer URL; ComponentLink1URL: http://www.analog.com/en/index.html; ComponentLink2Description: Datasheet; ComponentLink2URL: http://www.analog.com/static/imported-files/data_sheets/ADuM1200_1201.pdf; ComponentLink3Description: Package Specification; ComponentLink3URL: http://www.analog.com/static/imported-files/packages/PKG_PDF/SOIC_Narrow%20(R)/R_8.pdf; ComponentLink4Description: URL Link1; ComponentLink4URL: Product URL:http://www.analog.com/en/interface-isolation/digital-isolators/adum1200/products/product.html
U15 = TLP521: Text Field1: 80; Text Field2: 50

## Sheet relay.SchDoc
size A3
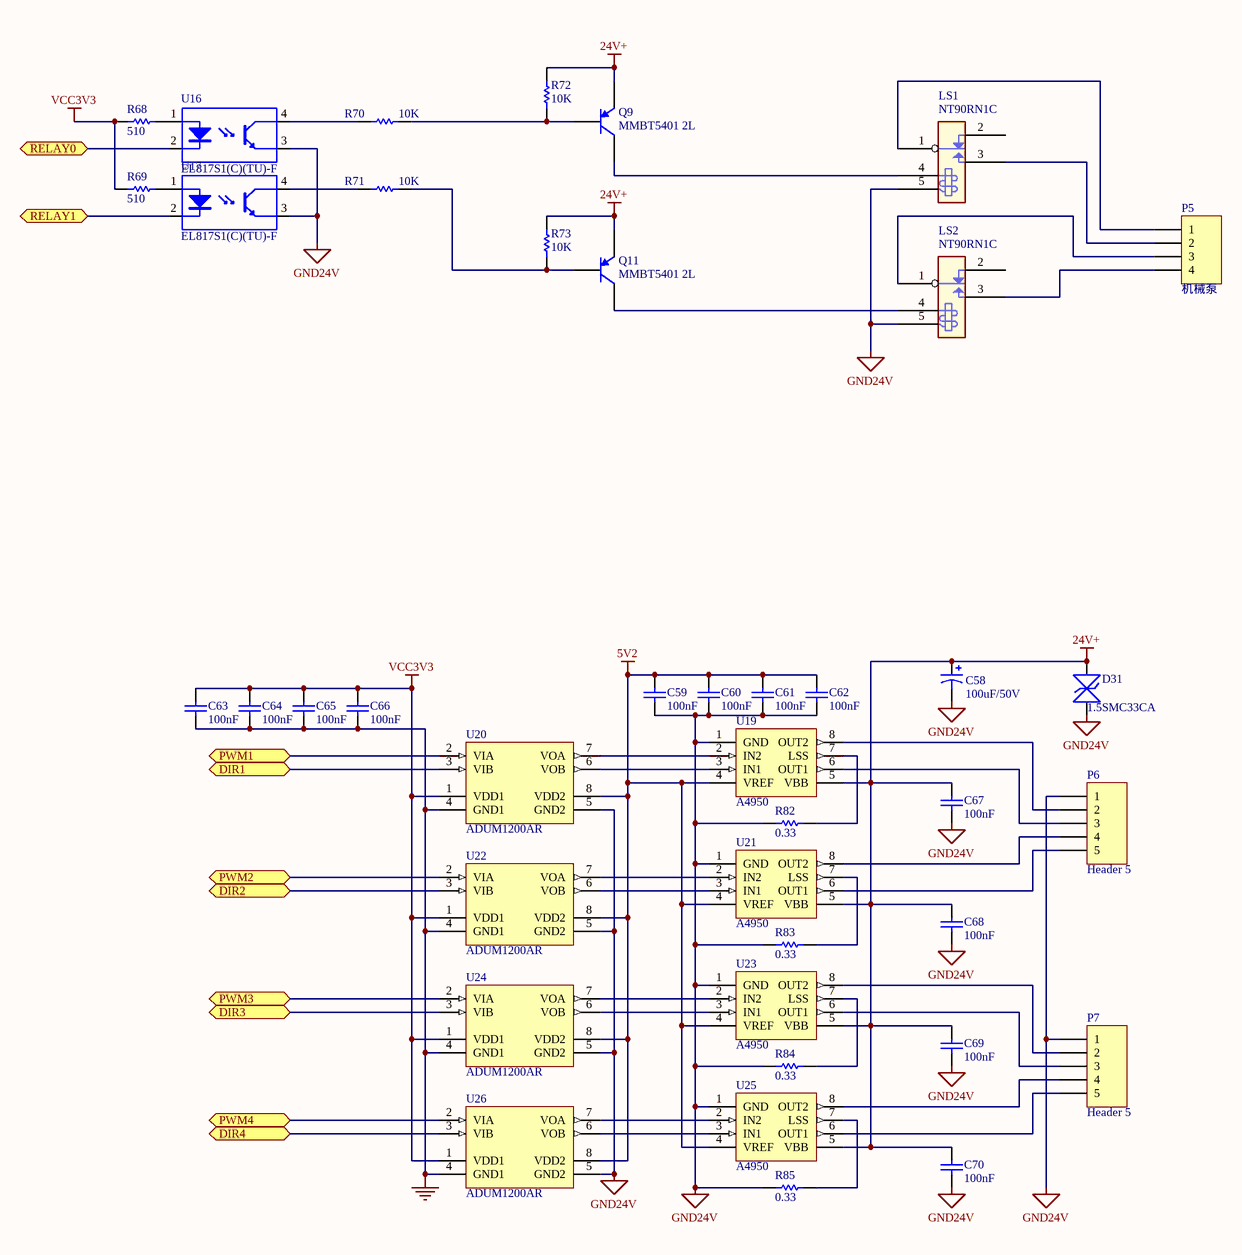
[diagram p3: relay.SchDoc]

### Parts
C58  100uF/50V  [CD1.5/3.2]
C59  100nF  [0805_C]
C60  100nF  [0805_C]
C61  100nF  [0805_C]
C62  100nF  [0805_C]
C63  100nF  [0805_C]
C64  100nF  [0805_C]
C65  100nF  [0805_C]
C66  100nF  [0805_C]
C67  100nF  [0805_C]
C68  100nF  [0805_C]
C69  100nF  [0805_C]
C70  100nF  [0805_C]
D31  1.5SMC33CA  [SMC(DO-214AB)_S1]
LS1  NT90RN1C  [NT90HCE12CE]
LS2  NT90RN1C  [NT90HCE12CE]
P5  机械泵  [MSTBV 2.5/4-G-5.08]
P6  Header 5  [MC1.5/5-ST-3.81]
P7  Header 5  [MC1.5/5-ST-3.81]
Q9  MMBT5401 2L  [SOT-23(SOT-23-3)]
Q11  MMBT5401 2L  [SOT-23(SOT-23-3)]
R68  510  [0805_R]
R69  510  [0805_R]
R70  10K  [0805_R]
R71  10K  [0805_R]
R72  10K  [0805_R]
R73  10K  [0805_R]
R82  0.33  [R2512]
R83  0.33  [R2512]
R84  0.33  [R2512]
R85  0.33  [R2512]
U16  EL817S1(C)(TU)-F  [LC-SMD-4]
U17  EL817S1(C)(TU)-F  [LC-SMD-4]
U19  A4950  [LC-SOIC-8_EP_150mil]
U20  ADUM1200AR  [ADI-R-8_N]
U21  A4950  [LC-SOIC-8_EP_150mil]
U22  ADUM1200AR  [ADI-R-8_N]
U23  A4950  [LC-SOIC-8_EP_150mil]
U24  ADUM1200AR  [ADI-R-8_N]
U25  A4950  [LC-SOIC-8_EP_150mil]
U26  ADUM1200AR  [ADI-R-8_N]

### Ports
DIR1, DIR2, DIR3, DIR4, PWM1, PWM2, PWM3, PWM4, RELAY0, RELAY1

### Nets
5V2: C59.2 C60.2 C61.2 C62.2 U19.4(VREF) U20.8(VDD2) U21.4(VREF) U22.8(VDD2) U23.4(VREF) U24.8(VDD2) U25.4(VREF) U26.8(VDD2)
24V+: C58.1 C67.2 C68.2 C69.2 C70.2 D31.2 Q9.2(E) Q11.2(E) R72.2 R73.2 U19.5(VBB) U21.5(VBB) U23.5(VBB) U25.5(VBB)
GND: C63.1 C64.1 C65.1 C66.1 U20.4(GND1) U22.4(GND1) U24.4(GND1) U26.4(GND1)
GND24V: C58.2 C59.1 C60.1 C61.1 C62.1 C67.1 C68.1 C69.1 C70.1 D31.1 LS1.5(COIL2) LS2.5(COIL2) P6.1 P7.1 R82.2 R83.2 R84.2 R85.2 U16.3(E) U17.3(E) U19.1(GND) U20.5(GND2) U21.1(GND) U22.5(GND2) U23.1(GND) U24.5(GND2) U25.1(GND) U26.5(GND2)
VCC3V3: C63.2 C64.2 C65.2 C66.2 R68.2 R69.2 U20.1(VDD1) U22.1(VDD1) U24.1(VDD1) U26.1(VDD1)
NetD4_1: U24.3(VIB) ; port DIR3
NetD4_2: U26.3(VIB) ; port DIR4
NetD4_3: U16.2(K) ; port RELAY0
NetD4_4: U17.2(K) ; port RELAY1
NetD4_59: U20.2(VIA) ; port PWM1
NetD4_60: U22.2(VIA) ; port PWM2
NetD4_61: U24.2(VIA) ; port PWM3
NetD4_62: U26.2(VIA) ; port PWM4
NetD4_97: U20.3(VIB) ; port DIR1
NetD4_98: U22.3(VIB) ; port DIR2
NetLS1_1: LS1.1(COMMON) P5.1
NetLS1_3: LS1.3(NO) P5.2
NetLS1_4: LS1.4(COIL1) Q9.3(C)
NetLS2_1: LS2.1(COMMON) P5.3
NetLS2_3: LS2.3(NO) P5.4
NetLS2_4: LS2.4(COIL1) Q11.3(C)
NetP6_2: P6.2 U19.8(OUT2)
NetP6_3: P6.3 U19.6(OUT1)
NetP6_4: P6.4 U21.8(OUT2)
NetP6_5: P6.5 U21.6(OUT1)
NetP7_2: P7.2 U23.8(OUT2)
NetP7_3: P7.3 U23.6(OUT1)
NetP7_4: P7.4 U25.8(OUT2)
NetP7_5: P7.5 U25.6(OUT1)
NetQ9_1: Q9.1(B) R70.2 R72.1
NetQ11_1: Q11.1(B) R71.2 R73.1
NetR68_1: R68.1 U16.1(A)
NetR69_1: R69.1 U17.1(A)
NetR70_1: R70.1 U16.4(C)
NetR71_1: R71.1 U17.4(C)
NetR82_1: R82.1 U19.7(LSS)
NetR83_1: R83.1 U21.7(LSS)
NetR84_1: R84.1 U23.7(LSS)
NetR85_1: R85.1 U25.7(LSS)
NetU19_2: U19.2(IN2) U20.7(VOA)
NetU19_3: U19.3(IN1) U20.6(VOB)
NetU21_2: U21.2(IN2) U22.7(VOA)
NetU21_3: U21.3(IN1) U22.6(VOB)
NetU23_2: U23.2(IN2) U24.7(VOA)
NetU23_3: U23.3(IN1) U24.6(VOB)
NetU25_2: U25.2(IN2) U26.7(VOA)
NetU25_3: U25.3(IN1) U26.6(VOB)

Not connected (* = marked no-connect by the designer): LS1 2(NC); LS2 2(NC)

### Library data of the parts
C58 = Cap Pol1: Polarized Capacitor (Radial); Value: 100pF; Published: 8-Jun-2000; LatestRevisionDate: 17-Jul-2002; LatestRevisionNote: Re-released for DXP Platform.; PackageReference: RB7.6-15; Publisher: Altium Limited
C59-C70 = 0805 100nF(104) 10% 50V: 贴片电容; ComponentLink1Description: 供应商链接; ComponentLink1URL: http://www.szlcsc.com/product/details_50686.html; Package: 0805; Supplier: LC; SuppliersPartNumber: C49678
D31 = TVS
P5 = Header 4H: Header, 4-Pin, Right Angle; LatestRevisionDate: 17-Jul-2002; LatestRevisionNote: Re-released for DXP Platform.; Publisher: Altium Limited
P6 P7 = Header 5: Header, 5-Pin; LatestRevisionDate: 17-Jul-2002; LatestRevisionNote: Re-released for DXP Platform.; Publisher: Altium Limited
Q9 Q11 = SOT-23 MMBT5401 2L: 三极管; ComponentLink1Description: 供应商链接; ComponentLink1URL: http://www.szlcsc.com/product/details_8818.html; Package: SOT-23; Supplier: LC; SuppliersPartNumber: C8326
R68-R73 R82-R85 = Res1: Resistor; Value: 1K; Published: 8-Jun-2000; LatestRevisionDate: 17-Jul-2002; LatestRevisionNote: Re-released for DXP Platform.; PackageReference: AXIAL-0.3; Publisher: Altium Limited
U16 U17 = TLP521: Text Field1: 80; Text Field2: 50
U20 U22 U24 U26 = ADUM1200AR: as U13 on sheet HV; DatasheetVersion: Rev. I; PackageVersion: 060506-A, 06/2006; PackageReference: R-8; PackageDescription: 8-Pin Standard Small Outline Package, Body 4.9 x 3.9 mm, Pitch 1.27 mm; Supplier 1: Digi-Key; Supplier Part Number 1: ADUM1200AR-ND; Supplier 2: Mouser; Supplier Part Number 2: 584-ADUM1200AR; Max Operating Temp (degreesC): 125; Mounting Technology: Surface Mount; Code_JEDEC: MS-012-AA; PartNumber: ADUM1200AR; ComponentLink1Description: Manufacturer URL; ComponentLink1URL: http://www.analog.com/en/index.html; ComponentLink2Description: Datasheet; ComponentLink2URL: http://www.analog.com/static/imported-files/data_sheets/ADuM1200_1201.pdf; ComponentLink3Description: Package Specification; ComponentLink3URL: http://www.analog.com/static/imported-files/packages/PKG_PDF/SOIC_Narrow%20(R)/R_8.pdf; ComponentLink4Description: URL Link1; ComponentLink4URL: Product URL:http://www.analog.com/en/interface-isolation/digital-isolators/adum1200/products/product.html

## Sheet uart.SchDoc
size A3
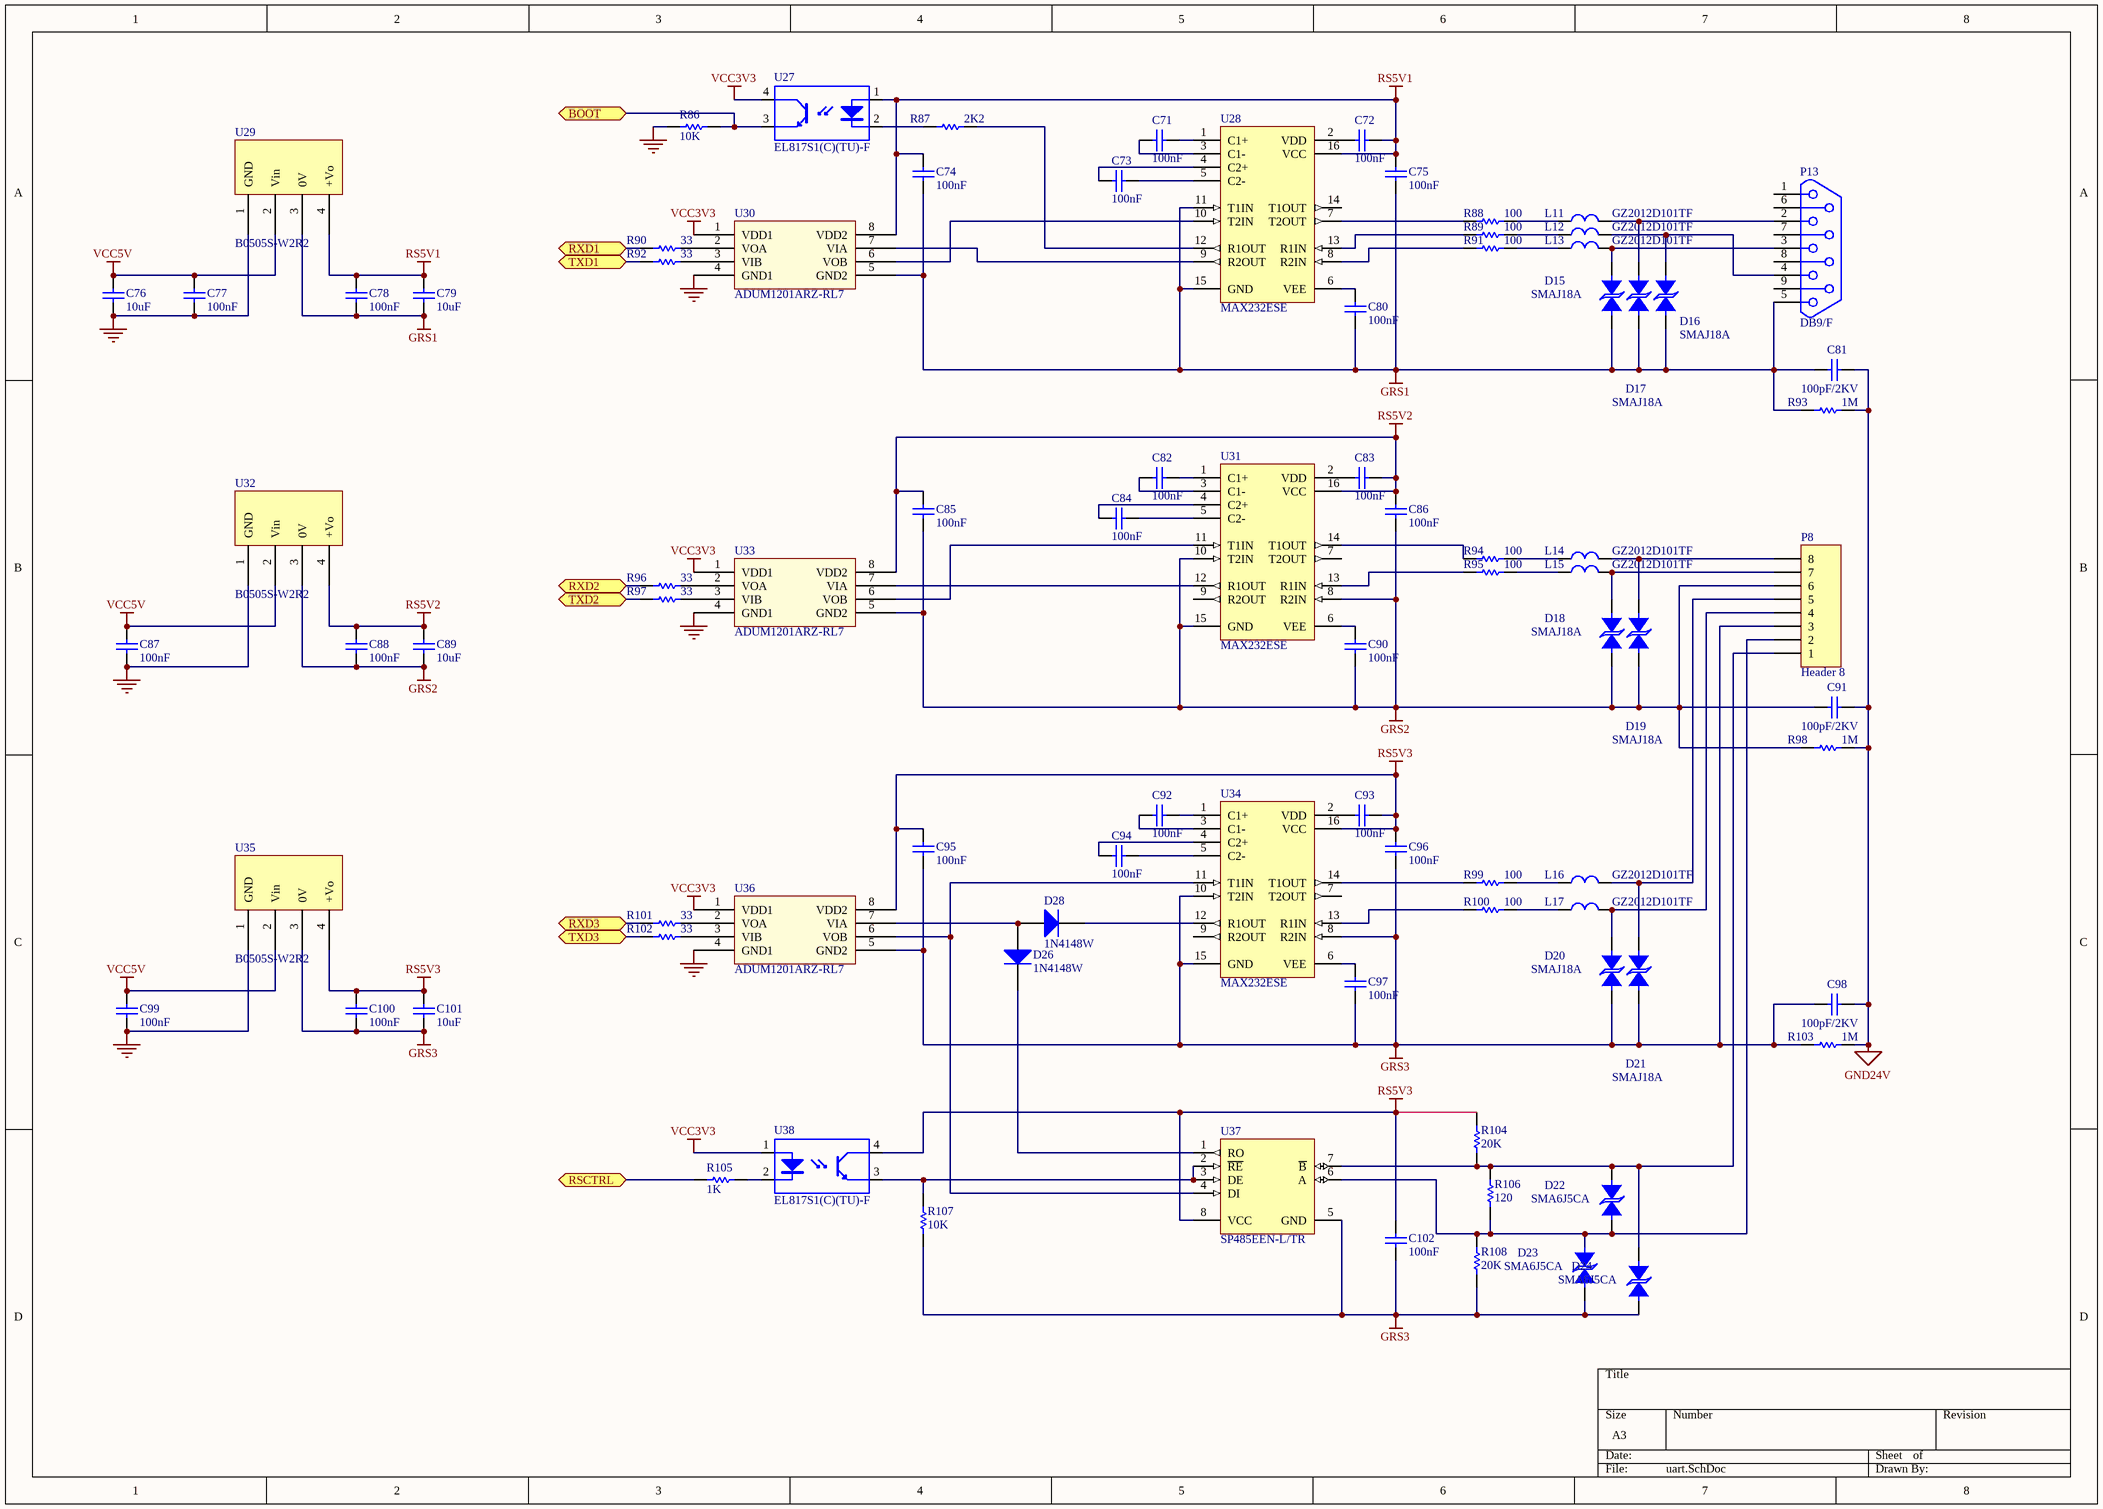
[diagram p4: uart.SchDoc]

### Parts
C71  100nF  [0805_C]
C72  100nF  [0805_C]
C73  100nF  [0805_C]
C74  100nF  [0805_C]
C75  100nF  [0805_C]
C76  10uF  [0805_C]
C77  100nF  [0805_C]
C78  100nF  [0805_C]
C79  10uF  [0805_C]
C80  100nF  [0805_C]
C81  100pF/2KV  [1206_C]
C82  100nF  [0805_C]
C83  100nF  [0805_C]
C84  100nF  [0805_C]
C85  100nF  [0805_C]
C86  100nF  [0805_C]
C87  100nF  [0805_C]
C88  100nF  [0805_C]
C89  10uF  [0805_C]
C90  100nF  [0805_C]
C91  100pF/2KV  [1206_C]
C92  100nF  [0805_C]
C93  100nF  [0805_C]
C94  100nF  [0805_C]
C95  100nF  [0805_C]
C96  100nF  [0805_C]
C97  100nF  [0805_C]
C98  100pF/2KV  [1206_C]
C99  100nF  [0805_C]
C100  100nF  [0805_C]
C101  10uF  [0805_C]
C102  100nF  [0805_C]
D15  SMAJ18A  [SMA]
D16  SMAJ18A  [SMA]
D17  SMAJ18A  [SMA]
D18  SMAJ18A  [SMA]
D19  SMAJ18A  [SMA]
D20  SMAJ18A  [SMA]
D21  SMAJ18A  [SMA]
D22  SMA6J5CA  [SMA]
D23  SMA6J5CA  [SMA]
D24  SMA6J5CA  [SMA]
D26  1N4148W  [SOD-123]
D28  1N4148W  [SOD-123]
L11  GZ2012D101TF  [0805_L]
L12  GZ2012D101TF  [0805_L]
L13  GZ2012D101TF  [0805_L]
L14  GZ2012D101TF  [0805_L]
L15  GZ2012D101TF  [0805_L]
L16  GZ2012D101TF  [0805_L]
L17  GZ2012D101TF  [0805_L]
P8  Header 8  [MC1.5/8-ST-3.81]
P13  DB9/F  [DB9P/F]
R86  10K  [0805_R]
R87  2K2  [0805_R]
R88  100  [0805_R]
R89  100  [0805_R]
R90  33  [0805_R]
R91  100  [0805_R]
R92  33  [0805_R]
R93  1M  [1206_R]
R94  100  [0805_R]
R95  100  [0805_R]
R96  33  [0805_R]
R97  33  [0805_R]
R98  1M  [1206_R]
R99  100  [0805_R]
R100  100  [0805_R]
R101  33  [0805_R]
R102  33  [0805_R]
R103  1M  [1206_R]
R104  20K  [0805_R]
R105  1K  [0805_R]
R106  120  [0805_R]
R107  10K  [0805_R]
R108  20K  [0805_R]
U27  EL817S1(C)(TU)-F  [LC-SMD-4]
U28  MAX232ESE  [SOIC-16_150mil]
U29  B0505S-W2R2  [MORNSUN-BM]
U30  ADUM1201ARZ-RL7  [SOIC-8_150mil]
U31  MAX232ESE  [SOIC-16_150mil]
U32  B0505S-W2R2  [MORNSUN-BM]
U33  ADUM1201ARZ-RL7  [SOIC-8_150mil]
U34  MAX232ESE  [SOIC-16_150mil]
U35  B0505S-W2R2  [MORNSUN-BM]
U36  ADUM1201ARZ-RL7  [SOIC-8_150mil]
U37  SP485EEN-L/TR  [SOIC-8_150mil]
U38  EL817S1(C)(TU)-F  [LC-SMD-4]

### Ports
BOOT, RSCTRL, RXD1, RXD2, RXD3, TXD1, TXD2, TXD3

### Nets
GND: C76.1 C77.2 C87.2 C99.2 R86.1 U29.1(GND) U30.4(GND1) U32.1(GND) U33.4(GND1) U35.1(GND) U36.4(GND1)
GND24V: C81.2 C91.2 C98.2 R93.2 R98.2 R103.2
GRS1: C74.2 C75.2 C78.2 C79.1 C80.1 C81.1 D15.1(ANODE) D16.1(ANODE) D17.1(ANODE) P13.5 R93.1 U28.11(T1IN) U28.15(GND) U29.3(0V) U30.5(GND2)
GRS2: C85.2 C86.2 C88.2 C89.1 C90.1 C91.1 D18.1(ANODE) D19.1(ANODE) P8.6 R98.1 U31.8(R2IN) U31.10(T2IN) U31.15(GND) U32.3(0V) U33.5(GND2)
GRS3: C95.2 C96.2 C97.1 C98.1 C100.2 C101.1 C102.1 D20.1(ANODE) D21.1(ANODE) D23.1(ANODE) D24.1(ANODE) P8.3 R103.1 R107.2 R108.2 U34.8(R2IN) U34.10(T2IN) U34.15(GND) U35.3(0V) U36.5(GND2) U37.5(GND)
RS5V1: C72.1 C74.1 C75.1 C78.1 C79.2 U27.1(A) U28.16(VCC) U29.4(+Vo) U30.8(VDD2)
RS5V2: C83.1 C85.1 C86.1 C88.1 C89.2 U31.16(VCC) U32.4(+Vo) U33.8(VDD2)
RS5V3: C93.1 C95.1 C96.1 C100.1 C101.2 C102.2 R104.1 U34.16(VCC) U35.4(+Vo) U36.8(VDD2) U37.8(VCC) U38.4(C)
VCC3V3: U27.4(C) U30.1(VDD1) U33.1(VDD1) U36.1(VDD1) U38.1(A)
VCC5V: C76.2 C77.1 C87.1 C99.1 U29.2(Vin) U32.2(Vin) U35.2(Vin)
PC10: R102.2 ; port TXD3
PC11: R101.1 ; port RXD3
NetC71_1: C71.1 U28.1(C1+)
NetC71_2: C71.2 U28.3(C1-)
NetC72_2: C72.2 U28.2(VDD)
NetC73_1: C73.1 U28.5(C2-)
NetC73_2: C73.2 U28.4(C2+)
NetC80_2: C80.2 U28.6(VEE)
NetC82_1: C82.1 U31.1(C1+)
NetC82_2: C82.2 U31.3(C1-)
NetC83_2: C83.2 U31.2(VDD)
NetC84_1: C84.1 U31.5(C2-)
NetC84_2: C84.2 U31.4(C2+)
NetC90_2: C90.2 U31.6(VEE)
NetC92_1: C92.1 U34.1(C1+)
NetC92_2: C92.2 U34.3(C1-)
NetC93_2: C93.2 U34.2(VDD)
NetC94_1: C94.1 U34.5(C2-)
NetC94_2: C94.2 U34.4(C2+)
NetC97_2: C97.2 U34.6(VEE)
NetD4_68: R92.2 ; port TXD1
NetD4_69: R90.1 ; port RXD1
NetD4_86: R97.2 ; port TXD2
NetD4_87: R96.1 ; port RXD2
NetD4_88: R105.1 ; port RSCTRL
NetD4_94: R86.2 U27.3(E) ; port BOOT
NetD15_2: D15.2(CATHODE) L13.2 P13.3
NetD16_2: D16.2(CATHODE) L12.2 P13.4
NetD17_2: D17.2(CATHODE) L11.2 P13.2
NetD18_2: D18.2(CATHODE) L15.2 P8.7
NetD19_2: D19.2(CATHODE) L14.2 P8.8
NetD20_2: D20.2(CATHODE) L17.2 P8.4
NetD21_2: D21.2(CATHODE) L16.2 P8.5
NetD22_1: D22.1(ANODE) D23.2(CATHODE) P8.2 R106.2 R108.1 U37.6(A)
NetD22_2: D22.2(CATHODE) D24.2(CATHODE) P8.1 R104.2 R106.1 U37.7(~{B})
NetD26_1: D26.1(A) D28.1(A) U36.7(VIA)
NetD26_2: D26.2(K) U37.1(RO)
NetD28_2: D28.2(K) U34.12(R1OUT)
NetL11_1: L11.1 R88.1
NetL12_1: L12.1 R89.1
NetL13_1: L13.1 R91.1
NetL14_1: L14.1 R94.1
NetL15_1: L15.1 R95.1
NetL16_1: L16.1 R99.1
NetL17_1: L17.1 R100.1
NetR87_1: R87.1 U27.2(K)
NetR87_2: R87.2 U28.12(R1OUT)
NetR88_2: R88.2 U28.7(T2OUT)
NetR89_2: R89.2 U28.13(R1IN)
NetR90_2: R90.2 U30.2(VOA)
NetR91_2: R91.2 U28.8(R2IN)
NetR92_1: R92.1 U30.3(VIB)
NetR94_2: R94.2 U31.14(T1OUT)
NetR95_2: R95.2 U31.13(R1IN)
NetR96_2: R96.2 U33.2(VOA)
NetR97_1: R97.1 U33.3(VIB)
NetR99_2: R99.2 U34.14(T1OUT)
NetR100_2: R100.2 U34.13(R1IN)
NetR101_2: R101.2 U36.2(VOA)
NetR102_1: R102.1 U36.3(VIB)
NetR105_2: R105.2 U38.2(K)
NetR107_1: R107.1 U37.2(~{RE}) U37.3(DE) U38.3(E)
NetU28_9: U28.9(R2OUT) U30.7(VIA)
NetU28_10: U28.10(T2IN) U30.6(VOB)
NetU31_11: U31.11(T1IN) U33.6(VOB)
NetU31_12: U31.12(R1OUT) U33.7(VIA)
NetU34_11: U34.11(T1IN) U36.6(VOB) U37.4(DI)

Not connected (* = marked no-connect by the designer): P13 1 6 7 8 9; U28 14(T1OUT); U31 7(T2OUT) 9(R2OUT); U34 7(T2OUT) 9(R2OUT)

### Library data of the parts
C71-C75 C77 C78 C80 C82-C88 C90 C92-C97 C99 C100 C102 = 0805 100nF(104) 10% 50V: 贴片电容; ComponentLink1Description: 供应商链接; ComponentLink1URL: http://www.szlcsc.com/product/details_50686.html; Package: 0805; Supplier: LC; SuppliersPartNumber: C49678
C76 C79 C89 C101 = 0805 10uF (106) 10% 25V: 贴片电容; ComponentLink1Description: 供应商链接; ComponentLink1URL: http://www.szlcsc.com/product/details_16532.html; Package: 0805; Supplier: LC; SuppliersPartNumber: C15850
C81 C91 C98 = Cap: Capacitor; Value: 100nF; Published: 8-Jun-2000; LatestRevisionDate: 17-Jul-2002; LatestRevisionNote: Re-released for DXP Platform.; PackageReference: RAD-0.3; Publisher: Altium Limited
D15-D24 = Bidirectional DIODE TVS: 1V5KE6V8CA
D26 D28 = Diode: Default Diode; Published: 8-Jun-2000; LatestRevisionDate: 17-Jul-2002; LatestRevisionNote: Re-released for DXP Platform.; PackageVersion: Sep-1996; PackageReference: SMC; Publisher: Altium Limited; Code_JEDEC: DO-214-AB
L11-L17 = L1
P8 = Header 8: Header, 8-Pin; LatestRevisionDate: 17-Jul-2002; LatestRevisionNote: Re-released for DXP Platform.; Publisher: Altium Limited
P13 = DB9
R86 R88 R89 R91 R94 R95 R99 R100 R104-R108 = Res1: Resistor; Value: 330; Published: 8-Jun-2000; LatestRevisionDate: 17-Jul-2002; LatestRevisionNote: Re-released for DXP Platform.; PackageReference: AXIAL-0.3; Publisher: Altium Limited
R87 R90 R93 R96 R98 R101 R103 = Res1: Resistor; Value: 5.1K; Published: 8-Jun-2000; LatestRevisionDate: 17-Jul-2002; LatestRevisionNote: Re-released for DXP Platform.; PackageReference: AXIAL-0.3; Publisher: Altium Limited
R92 R97 R102 = Res1: Resistor; Value: 10K; Published: 8-Jun-2000; LatestRevisionDate: 17-Jul-2002; LatestRevisionNote: Re-released for DXP Platform.; PackageReference: AXIAL-0.3; Publisher: Altium Limited
U27 U38 = TLP521: Text Field1: 80; Text Field2: 50
U28 U31 U34 = MAX232ESE_[C26860]: RS232; ComponentLink1Description: 供应商链接; ComponentLink1URL: http://www.szlcsc.com/product/details_27608.html; Package: SOIC-16_150mil; Supplier: LC; SuppliersPartNumber: C26860
U29 U32 U35 = MORNSUN-BM: MORNSUN Fixed input,Isolated,Unregulated Series DC/DC
U30 U33 U36 = ADUM1201ARZ-RL7_[C9669]: 隔离器; ComponentLink1Description: 供应商链接; ComponentLink1URL: http://www.szlcsc.com/product/details_10199.html; Package: SOIC-8_150mil; Supplier: LC; SuppliersPartNumber: C9669
U37 = SP485EEN-L/TR_[C6855]: RS-485/RS-422; ComponentLink1Description: 供应商链接; ComponentLink1URL: http://www.szlcsc.com/product/details_7327.html; Package: SOIC-8; Supplier: LC; SuppliersPartNumber: C6855

## Sheet EtherNet.SchDoc
size A4; Revision: C.1(PCB.SCH)
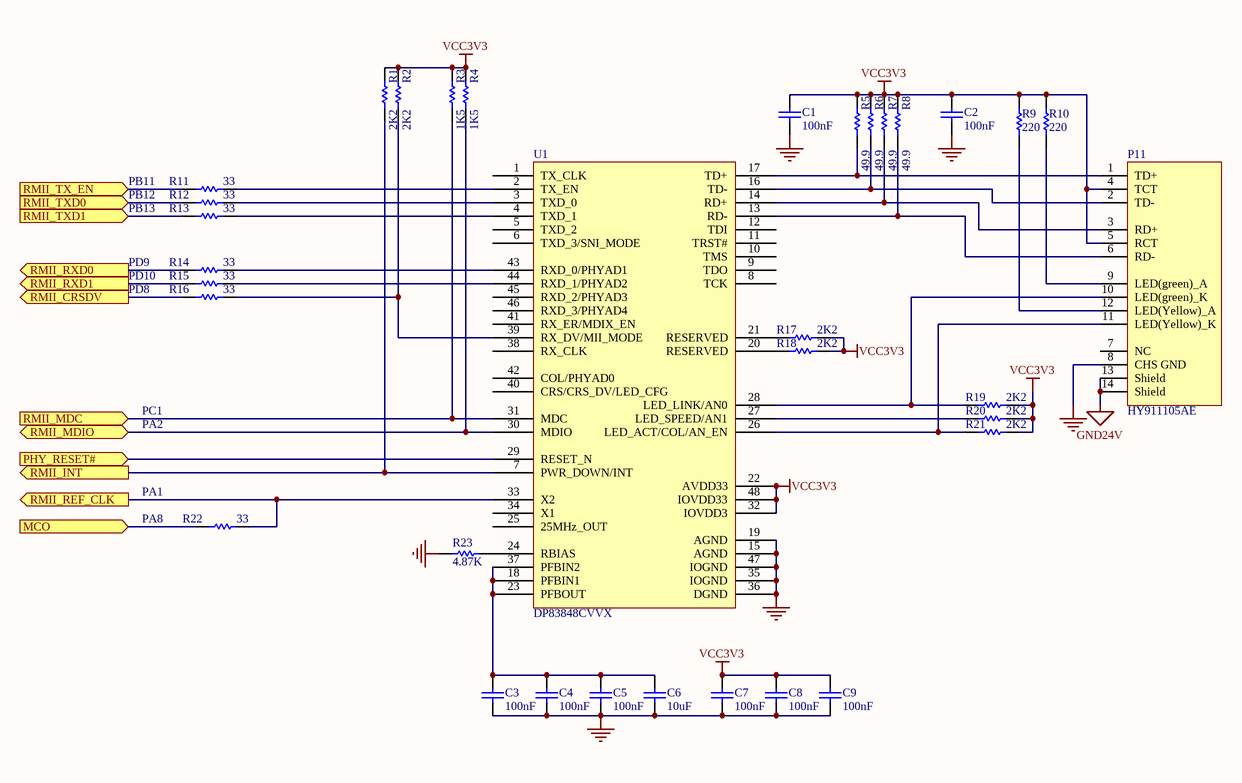
[diagram p5: EtherNet.SchDoc]

### Parts
C1  100nF  [0805_C]
C2  100nF  [0805_C]
C3  100nF  [0805_C]
C4  100nF  [0805_C]
C5  100nF  [0805_C]
C6  10uF  [0805_C]
C7  100nF  [0805_C]
C8  100nF  [0805_C]
C9  100nF  [0805_C]
P11  HY911105AE  [HANRUN-A8]
R1  2K2  [0805_R]
R2  2K2  [0805_R]
R3  1K5  [0805_R]
R4  1K5  [0805_R]
R5  49.9  [0805_R]
R6  49.9  [0805_R]
R7  49.9  [0805_R]
R8  49.9  [0805_R]
R9  220  [0805_R]
R10  220  [0805_R]
R11  33  [0805_R]
R12  33  [0805_R]
R13  33  [0805_R]
R14  33  [0805_R]
R15  33  [0805_R]
R16  33  [0805_R]
R17  2K2  [0805_R]
R18  2K2  [0805_R]
R19  2K2  [0805_R]
R20  2K2  [0805_R]
R21  2K2  [0805_R]
R22  33  [0805_R]
R23  4.87K  [0805_R]
U1  DP83848CVVX  [LQFP-48_7x7x05P]

### Ports
MCO (in), PHY_RESET# (in), RMII_CRSDV (out), RMII_INT (out), RMII_MDC (in), RMII_MDIO (bidir), RMII_REF_CLK (out), RMII_RXD0 (out), RMII_RXD1 (out), RMII_TX_EN (in), RMII_TXD0 (in), RMII_TXD1 (in)

### Nets
GND: C1.2 C2.2 C3.2 C4.2 C5.2 C6.1 C7.2 C8.2 C9.2 P11.8(CHS_GND) R23.1 U1.15(AGND) U1.19(AGND) U1.35(IOGND) U1.36(DGND) U1.47(IOGND)
GND24V: P11.13(Shield) P11.14(Shield)
VCC3V3: C1.1 C2.1 C7.1 C8.1 C9.1 P11.4(TCT) P11.5(RCT) R1.2 R2.2 R3.2 R4.2 R5.2 R6.2 R7.2 R8.2 R9.2 R10.2 R17.2 R18.2 R19.2 R20.2 R21.2 U1.22(AVDD33) U1.32(IOVDD3) U1.48(IOVDD33)
PC1: R3.1 U1.31(MDC) ; port RMII_MDC
NetC3_1: C3.1 C4.1 C5.1 C6.2 U1.18(PFBIN1) U1.23(PFBOUT) U1.37(PFBIN2)
NetD4_24: R22.1 U1.33(X2) ; port RMII_REF_CLK
NetD4_25: R4.1 U1.30(MDIO) ; port RMII_MDIO
NetD4_48: R11.2 ; port RMII_TX_EN
NetD4_51: R12.2 ; port RMII_TXD0
NetD4_52: R13.2 ; port RMII_TXD1
NetD4_53: R1.1 U1.7(PWR_DOWN/INT) ; port RMII_INT
NetD4_55: R16.2 ; port RMII_CRSDV
NetD4_56: R14.2 ; port RMII_RXD0
NetD4_57: R15.2 ; port RMII_RXD1
NetD4_58: U1.29(RESET_N) ; port PHY_RESET#
NetD4_67: R22.2 ; port MCO
NetP11_1: P11.1(TD+) R5.1 U1.17(TD+)
NetP11_2: P11.2(TD-) R6.1 U1.16(TD-)
NetP11_3: P11.3(RD+) R7.1 U1.14(RD+)
NetP11_6: P11.6(RD-) R8.1 U1.13(RD-)
NetP11_9: P11.9(LED(green)_A) R10.1
NetP11_10: P11.10(LED(green)_K) R19.1 U1.28(LED_LINK/AN0)
NetP11_11: P11.11(LED(Yellow)_K) R21.1 U1.26(LED_ACT/COL/AN_EN)
NetP11_12: P11.12(LED(Yellow)_A) R9.1
NetR2_1: R2.1 R16.1 U1.39(RX_DV/MII_MODE)
NetR11_1: R11.1 U1.2(TX_EN)
NetR12_1: R12.1 U1.3(TXD_0)
NetR13_1: R13.1 U1.4(TXD_1)
NetR14_1: R14.1 U1.43(RXD_0/PHYAD1)
NetR15_1: R15.1 U1.44(RXD_1/PHYAD2)
NetR17_1: R17.1 U1.21(RESERVED)
NetR18_1: R18.1 U1.20(RESERVED)
NetR20_1: R20.1 U1.27(LED_SPEED/AN1)
NetR23_2: R23.2 U1.24(RBIAS)

Not connected (* = marked no-connect by the designer): P11 7(NC); U1 1(TX_CLK) 5(TXD_2) 6(TXD_3/SNI_MODE) 8(TCK) 9(TDO) 10(TMS) 11(TRST#) 12(TDI) 25(25MHz_OUT) 34(X1) 38(RX_CLK) 40(CRS/CRS_DV/LED_CFG) 41(RX_ER/MDIX_EN) 42(COL/PHYAD0) 45(RXD_2/PHYAD3) 46(RXD_3/PHYAD4)

### Notes on the sheet
- PB11
- PB12
- PB13
- PD9
- PD10
- PD8
- PC1
- PA2
- PA1
- (near R22) PA8
- Title
- Size:
- Date:
- A4
- Number:
- Time:
- Revision:
- Sheet
- of
- File:

### Library data of the parts
C1-C5 C7-C9 = 0805 100nF(104) 10% 50V: 贴片电容; ComponentLink1Description: 供应商链接; ComponentLink1URL: http://www.szlcsc.com/product/details_50686.html; Package: 0805; Supplier: LC; SuppliersPartNumber: C49678
C6 = 0805 10uF (106) 10% 25V: 贴片电容; ComponentLink1Description: 供应商链接; ComponentLink1URL: http://www.szlcsc.com/product/details_16532.html; Package: 0805; Supplier: LC; SuppliersPartNumber: C15850
P11 = J0011D21B
R1-R23 = Res1: Resistor; Value: 1K; Published: 8-Jun-2000; Revision: July-2002: Re-released for DXP Platform.; Publisher: Altium Limited
U1 = DP83848CVVX_[C16688]: 接口芯片; ComponentLink1Description: 供应商链接; ComponentLink1URL: http://www.szlcsc.com/product/details_17371.html; Package: LQFP-48_7x7x05P; Supplier: LC; SuppliersPartNumber: C16688

## Sheet POWER.SchDoc
size A4
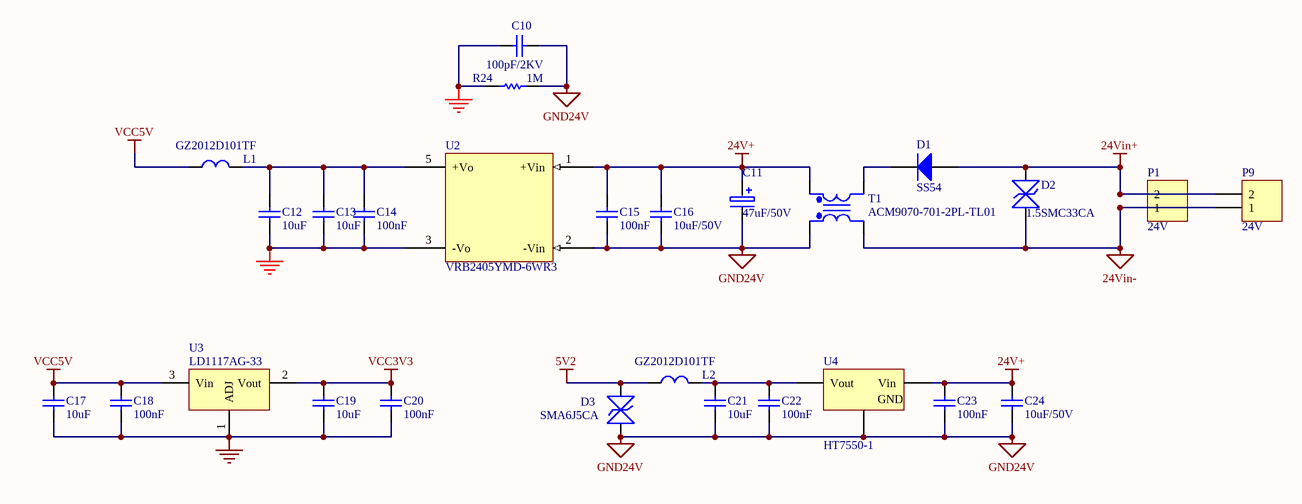
[diagram p6: POWER.SchDoc]

### Parts
C10  100pF/2KV  [1206_C]
C11  47uF/50V  [CD1/2]
C12  10uF  [0805_C]
C13  10uF  [0805_C]
C14  100nF  [0805_C]
C15  100nF  [0805_C]
C16  10uF/50V  [1206_C]
C17  10uF  [0805_C]
C18  100nF  [0805_C]
C19  10uF  [0805_C]
C20  100nF  [0805_C]
C21  10uF  [0805_C]
C22  100nF  [0805_C]
C23  100nF  [0805_C]
C24  10uF/50V  [1206_C]
D1  SS54  [SMA(DO-214AC)_S1]
D2  1.5SMC33CA  [SMC(DO-214AB)_S1]
D3  SMA6J5CA  [SMA]
L1  GZ2012D101TF  [0805_L]
L2  GZ2012D101TF  [0805_L]
P1  24V  [mc1.5/2-st-3.81]
P9  24V  [mc1.5/2-st-3.81]
R24  1M  [1206_R]
T1  ACM9070-701-2PL-TL01  [ACM1211]
U2  VRB2405YMD-6WR3  [DC/DC-1X1]
U3  LD1117AG-33  [SOT-223]
U4  HT7550-1  [SOT-89(SOT-89-3)]

### Nets
5V2: D3.1 L2.2
24V+: C11.1 C15.2 C16.2 C23.2 C24.2 T1.2(Pri+) U2.1(+Vin) U4.2(Vin)
24Vin+: D1.1(A) D2.2 P1.2 P9.2
24Vin-: D2.1 P1.1 P9.1 T1.4(Sec-)
GND: C10.1 C12.1 C13.1 C14.1 C17.1 C18.1 C19.1 C20.1 R24.1 U2.3(-Vo) U3.1(ADJ)
GND24V: C10.2 C11.2 C15.1 C16.1 C21.1 C22.1 C23.1 C24.1 D3.2 R24.2 T1.1(Sec+) U2.2(-Vin) U4.1(GND)
NC: U2.4(NC)
VCC3V3: C19.2 C20.2 U3.2(Vout)
VCC5V: C17.2 C18.2 L1.2 U3.3(Vin)
NetC12_2: C12.2 C13.2 C14.2 L1.1 U2.5(+Vo)
NetC21_2: C21.2 C22.2 L2.1 U4.3(Vout)
NetD1_2: D1.2(K) T1.3(Pri-)

### Library data of the parts
C10 = Cap: Capacitor; Value: 100nF; Published: 8-Jun-2000; LatestRevisionDate: 17-Jul-2002; LatestRevisionNote: Re-released for DXP Platform.; PackageReference: RAD-0.3; Publisher: Altium Limited
C11 = CD1: Electrolytic Capacitor; Text Field1: 4.7uF:4V-A;6.3V-A;10V-A;16V-BA;20V-BA;25V-CB;35V-DC;50V-D;; Text Field2: 10uF:4V-AB;6.3V-BA;10V-BA;16V-CBA;20V-CB;25V-DC;35V-D;; Text Field3: 22uF:4V-BA;6.3V-CBA;10V-CB;16V-DBC;20V-DC;25V-D;35V-D;; Text Field4: 33uF:4V-CAB;6.3V-CBA;10V-DBC;16V-DCB;20V-DC;25V-DE;; Text Field5: 47uF:4V-CBA;6.3V-DBC;10V-DBC;16V-DC;20V-DE;; Text Field6: 68uF:4V-DBC;6.3V-DCB;10V-DCB;16V-D;20V-DE;; Text Field7: 100uF:4V-DCB;6.3V-EDBC;10V-DC;16V-DE;20V-E;; Text Field8: 220uF:4V-EDC;6.3V-ED;10V-ED;
C12 C13 C17 C19 C21 = 0805 10uF (106) 10% 25V: 贴片电容; ComponentLink1Description: 供应商链接; ComponentLink1URL: http://www.szlcsc.com/product/details_16532.html; Package: 0805; Supplier: LC; SuppliersPartNumber: C15850
C14 C15 C18 C20 C22 C23 = 0805 100nF(104) 10% 50V: 贴片电容; ComponentLink1Description: 供应商链接; ComponentLink1URL: http://www.szlcsc.com/product/details_50686.html; Package: 0805; Supplier: LC; SuppliersPartNumber: C49678
C16 C24 = 1206 10uF (106) 10% 50V: 贴片电容; ComponentLink1Description: 供应商链接; ComponentLink1URL: http://www.szlcsc.com/product/details_14236.html; Package: 1206; Supplier: LC; SuppliersPartNumber: C13585
D1 = SMA(DO-214AC) SS54: 二极管; ComponentLink1Description: 供应商链接; ComponentLink1URL: http://www.szlcsc.com/product/details_23178.html; Package: SMA(DO-214AC); Supplier: LC; SuppliersPartNumber: C22452
D2 D3 = TVS
L1 L2 = L1
P1 P9 = Header 2: Header, 2-Pin; LatestRevisionDate: 17-Jul-2002; LatestRevisionNote: Re-released for DXP Platform.; Publisher: Altium Limited
R24 = Res1: Resistor; Value: 5.1K; Published: 8-Jun-2000; LatestRevisionDate: 17-Jul-2002; LatestRevisionNote: Re-released for DXP Platform.; PackageReference: AXIAL-0.3; Publisher: Altium Limited
T1 = ACP3225: TDP ACP3225 Common Mode Filters; Published: 8-Jun-2000; LatestRevisionDate: 17-Jul-2002; LatestRevisionNote: Re-released for DXP Platform.; PackageReference: TRF_4; Publisher: Altium Limited; PackageDescription: Transformer; 4 Leads
U2 = 48S5: Text Field1: 80; Text Field2: 80
U3 = LM1117: 3-Terminal Adjustable Positive Voltage Regulator
U4 = SOT-89 HT7550-1: 低压差线性稳压(LDO); ComponentLink1Description: 供应商链接; ComponentLink1URL: http://www.szlcsc.com/product/details_16788.html; Package: SOT-89; Supplier: LC; SuppliersPartNumber: C16106

## Nets that join several sheets
5V2: 1 (C49_1.2 R45_1.2 U13_1.8), relay (12 pins), POWER (D3.1 L2.2), 3 (C49_3.2 R45_3.2 U13_3.8), 2 (C49_2.2 R45_2.2 U13_2.8)
24V+: 1 (12 pins), relay (14 pins), POWER (8 pins), 3 (12 pins), 2 (12 pins)
GND: stm32 (33 pins), 1 (12 pins), relay (8 pins), uart (11 pins), EtherNet (16 pins), POWER (11 pins), 3 (12 pins), 2 (12 pins)
GND24V: AL1000 (18 pins), 1 (35 pins), relay (28 pins), uart (6 pins), EtherNet (P11.13 P11.14), POWER (13 pins), 3 (35 pins), 2 (35 pins)
REF2V5: 1 (5 pins), 3 (5 pins), 2 (5 pins)
VCC3V3: stm32 (24 pins), 1 (C48_1.2 L5_1.1 U13_1.1 U15_1.1), relay (10 pins), uart (5 pins), EtherNet (25 pins), POWER (C19.2 C20.2 U3.2), 3 (C48_3.2 L5_3.1 U13_3.1 U15_3.1), 2 (C48_2.2 L5_2.1 U13_2.1 U15_2.1)
VCC5V: stm32 (P2.6 P10.29), uart (7 pins), POWER (C17.2 C18.2 L1.2 U3.3)
NetC42_2_2: stm32 (D4.30), 2 (C42_2.2 R37_2.2)
NetC46_2_2: stm32 (D4.29), 2 (C46_2.2 R42_2.2)
NetD4_1: stm32 (D4.1), relay (U24.3)
NetD4_2: stm32 (D4.2), relay (U26.3)
NetD4_3: stm32 (D4.3), relay (U16.2)
NetD4_4: stm32 (D4.4), relay (U17.2)
NetD4_23: stm32 (D4.23), 1 (U13_1.3)
NetD4_24: stm32 (D4.24), EtherNet (R22.1 U1.33)
NetD4_25: stm32 (D4.25), EtherNet (R4.1 U1.30)
NetD4_26: stm32 (D4.26), 1 (U13_1.2)
NetD4_48: stm32 (D4.48), EtherNet (R11.2)
NetD4_51: stm32 (D4.51), EtherNet (R12.2)
NetD4_52: stm32 (D4.52), EtherNet (R13.2)
NetD4_53: stm32 (D4.53), EtherNet (R1.1 U1.7)
NetD4_55: stm32 (D4.55), EtherNet (R16.2)
NetD4_56: stm32 (D4.56), EtherNet (R14.2)
NetD4_57: stm32 (D4.57), EtherNet (R15.2)
NetD4_58: stm32 (D4.58), EtherNet (U1.29)
NetD4_59: stm32 (D4.59), relay (U20.2)
NetD4_60: stm32 (D4.60), relay (U22.2)
NetD4_61: stm32 (D4.61), relay (U24.2)
NetD4_62: stm32 (D4.62), relay (U26.2)
NetD4_67: stm32 (D4.67), EtherNet (R22.2)
NetD4_68: stm32 (D4.68), uart (R92.2)
NetD4_69: stm32 (D4.69), uart (R90.1)
NetD4_84: stm32 (D4.84), 2 (R67_2.1)
NetD4_85: stm32 (D4.85), 1 (R67_1.1)
NetD4_86: stm32 (D4.86), uart (R97.2)
NetD4_87: stm32 (D4.87), uart (R96.1)
NetD4_88: stm32 (D4.88), uart (R105.1)
NetD4_94: stm32 (D4.94), uart (R86.2 U27.3)
NetD4_97: stm32 (D4.97), relay (U20.3)
NetD4_98: stm32 (D4.98), relay (U22.3)
PC1: stm32 (D4.16), EtherNet (R3.1 U1.31)
PC2: stm32 (D4.17), 3 (C46_3.2 R42_3.2)
PC3: stm32 (D4.18), 3 (C42_3.2 R37_3.2)
PC4: stm32 (D4.33), 1 (C46_1.2 R42_1.2)
PC5: stm32 (D4.34), 1 (C42_1.2 R37_1.2)
PC6: stm32 (D4.63), 3 (U13_3.2)
PC7: stm32 (D4.64), 3 (U13_3.3)
PC8: stm32 (D4.65), 2 (U13_2.2)
PC9: stm32 (D4.66), 2 (U13_2.3)
PC10: stm32 (D4.78), uart (R102.2)
PC11: stm32 (D4.79), uart (R101.1)
PC13: stm32 (D4.7), 3 (R67_3.1)